# Altium project LOGI-PI.PrjPcb (part 1 of 2)
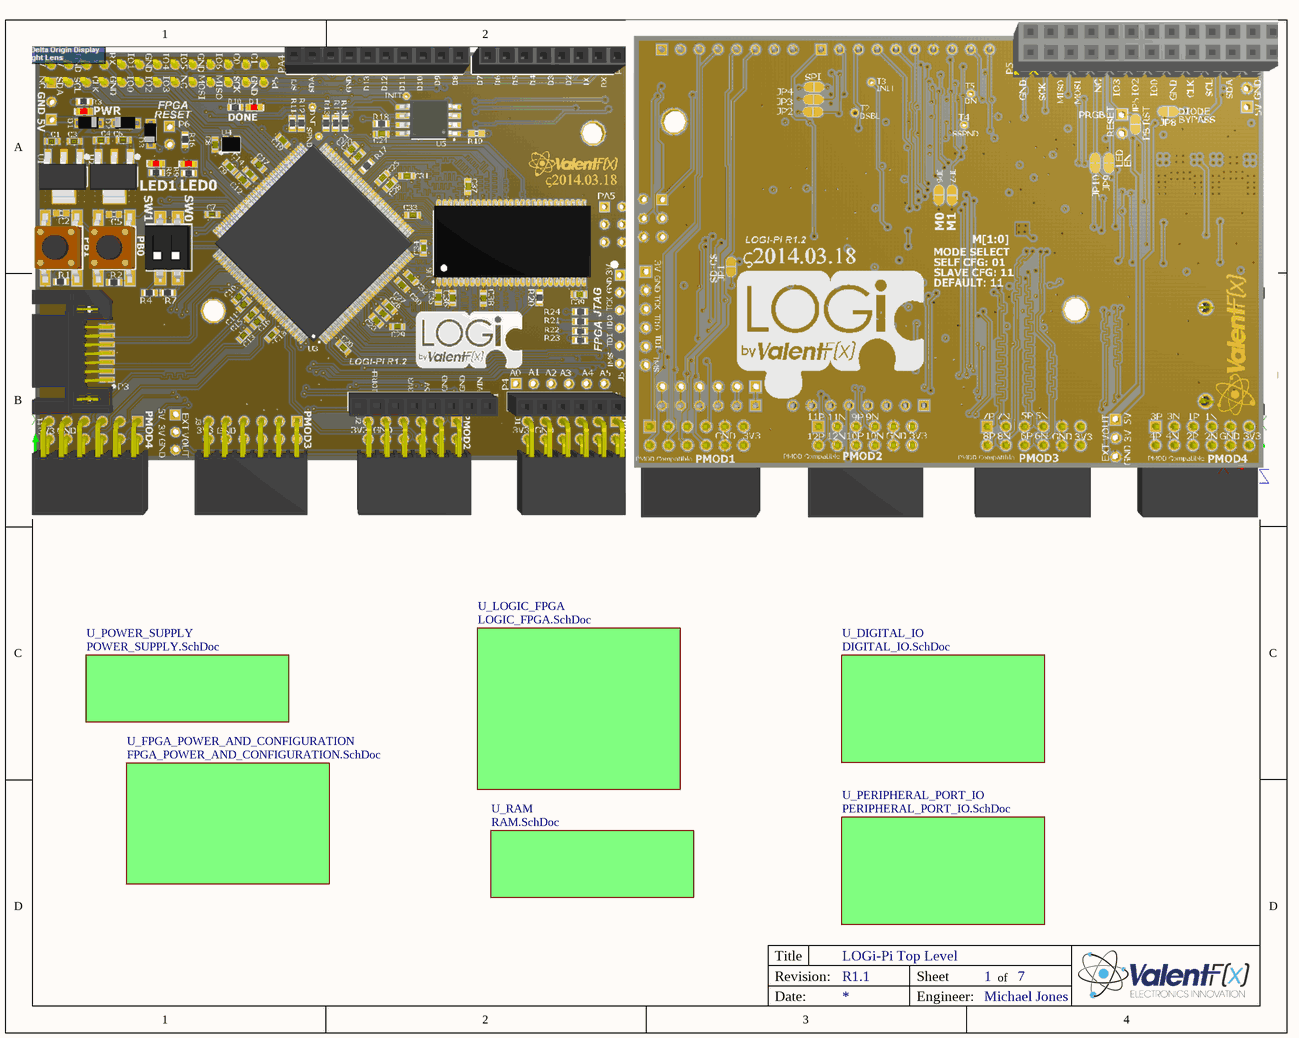
[diagram p0: LOGi_Pi_Top.SchDoc]
PrjEngineer: Michael Jones; PrjRevision: R1.1
7 sheets, 111 parts. Net scope: flat (ports and power ports of the same name join across sheets).
Board file: LOGI-PI.PcbDoc
Sheets:
  LOGi_Pi_Top.SchDoc
    U_DIGITAL_IO = DIGITAL_IO.SchDoc
    U_FPGA_POWER_AND_CONFIGURATION = FPGA_POWER_AND_CONFIGURATION.SchDoc
    U_LOGIC_FPGA = LOGIC_FPGA.SchDoc
    U_PERIPHERAL_PORT_IO = PERIPHERAL_PORT_IO.SchDoc
    U_POWER_SUPPLY = POWER_SUPPLY.SchDoc
    U_RAM = RAM.SchDoc

## Sheet LOGi_Pi_Top.SchDoc: LOGi-Pi Top Level
size A; Organization: Michael Jones; DocumentNumber: 1; SheetNumber: 1; SheetTotal: 7; PageSetup: Record=PageOptions|CenterHorizontal=True|CenterVertical=True|PrintScale=1.12|XCorrection=1.00|YCorrection=1.00|PrintKind=0|BorderSize=5000000|LeftOffset=0|BottomOffset=0|Orientation=2|PaperLength=1000|PaperWidth=1000|Scale=100|PaperSource=7|PrintQuality=-4|MediaType=1|DitherType=10|PaperKind=Letter|PrintScaleMode=1

### Sub-sheets
U_DIGITAL_IO = DIGITAL_IO.SchDoc: no entries
U_FPGA_POWER_AND_CONFIGURATION = FPGA_POWER_AND_CONFIGURATION.SchDoc: no entries
U_LOGIC_FPGA = LOGIC_FPGA.SchDoc: no entries
U_PERIPHERAL_PORT_IO = PERIPHERAL_PORT_IO.SchDoc: no entries
U_POWER_SUPPLY = POWER_SUPPLY.SchDoc: no entries
U_RAM = RAM.SchDoc: no entries

### Notes on the sheet
- Title
- Revision:
- Sheet
- of
- Date:
- Engineer:

## Sheet DIGITAL_IO.SchDoc: Digital IO
size B; Engineer: M. Jones; Organization: Michael Jones; DocumentNumber: 6; Revision: RA.1; SheetNumber: 6; SheetTotal: 7
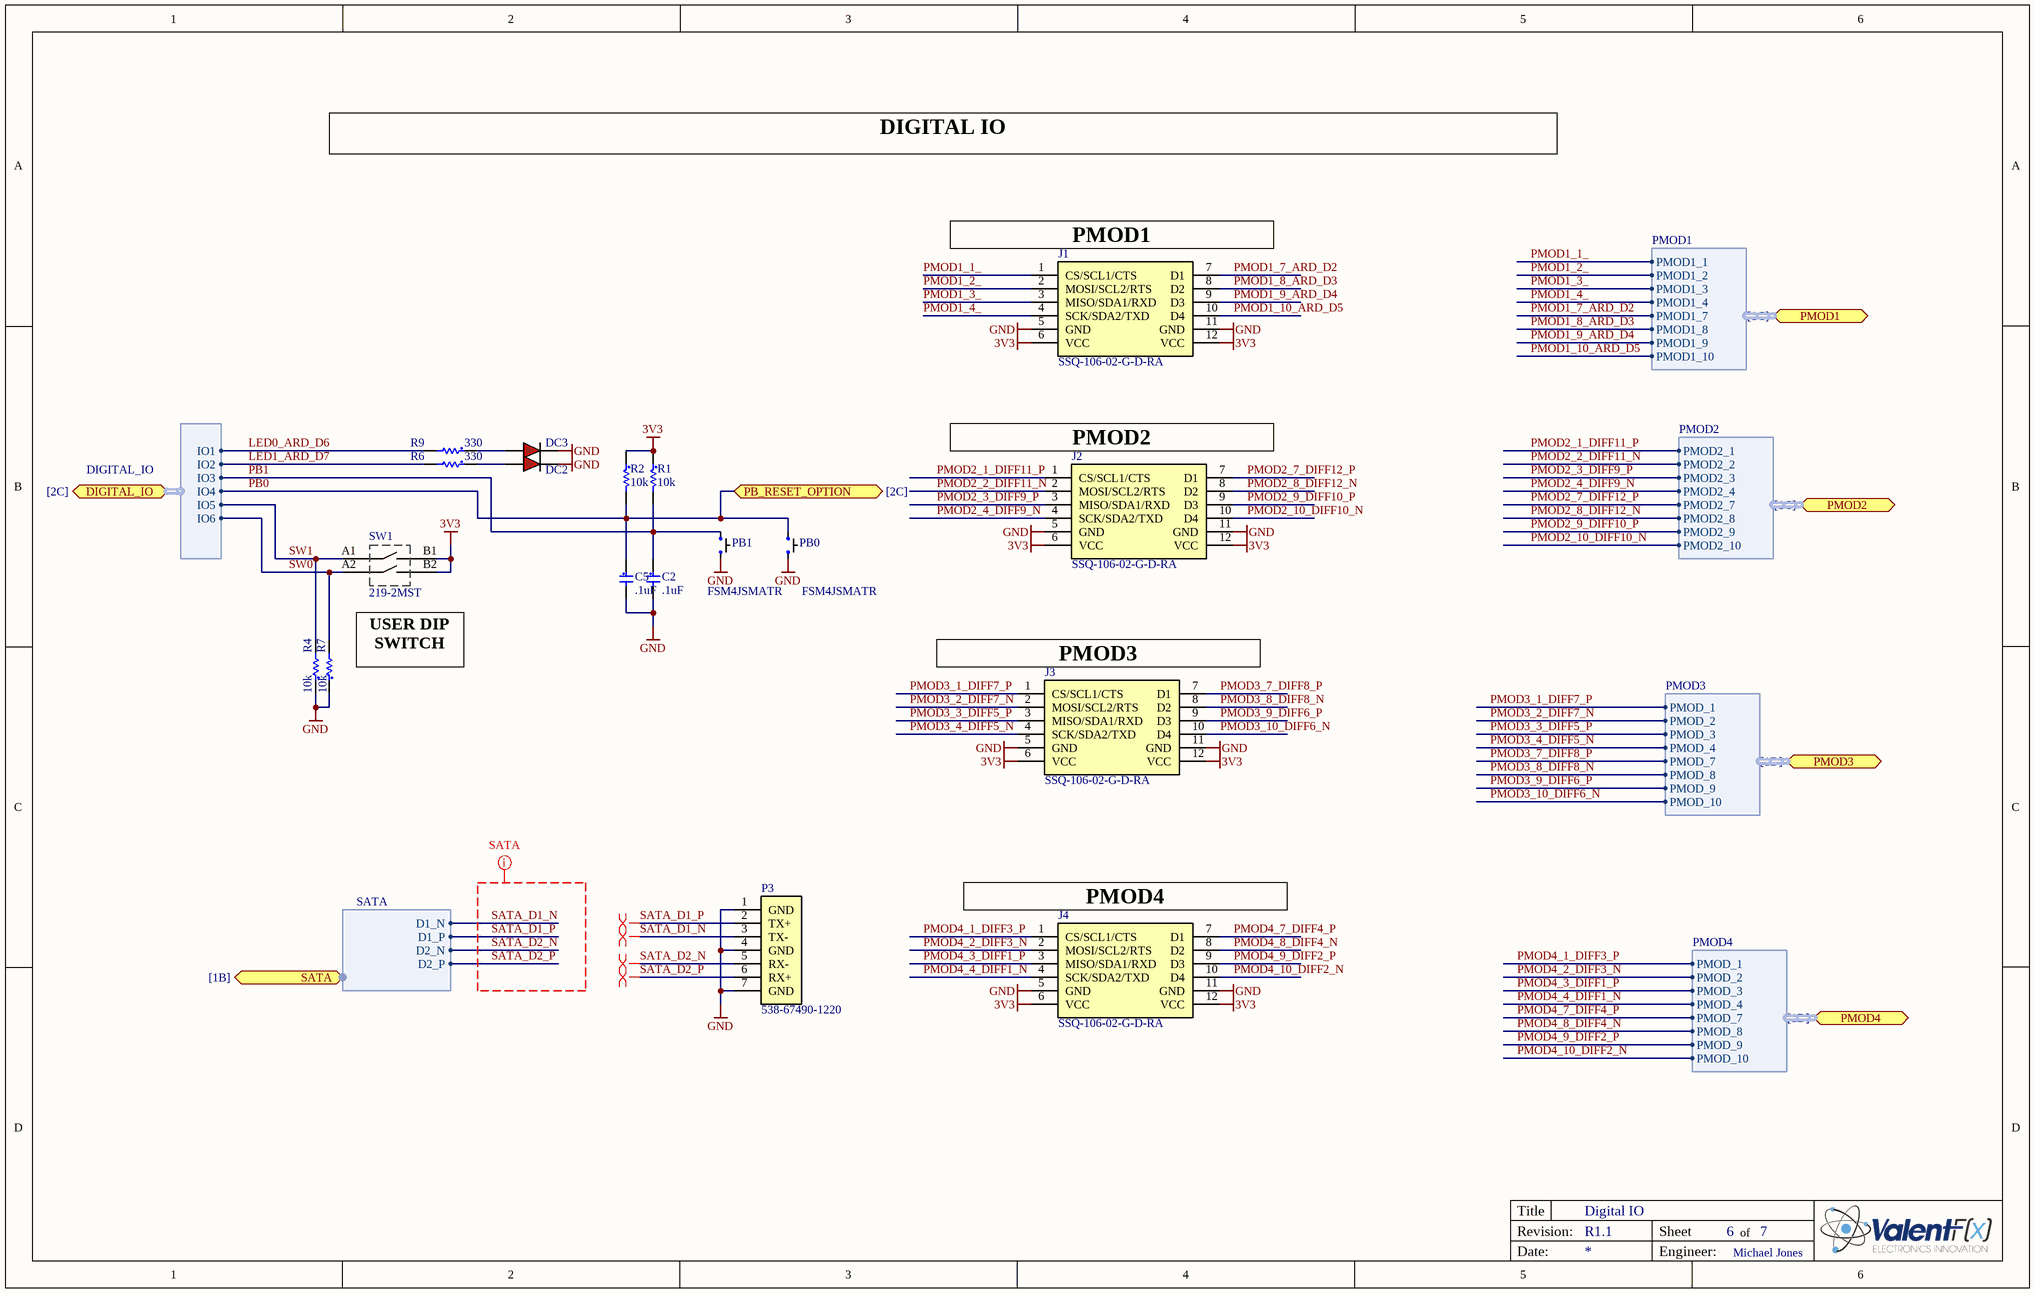
[diagram p1: DIGITAL_IO.SchDoc]

### Parts
C2  .1uF  [c0603]
C5  .1uF  [c0603]
DC2  598-8010-107F  [LED_0603 - RED]  (value not drawn)
DC3  598-8010-107F  [LED_0603 - RED]  (value not drawn)
J1  SSQ-106-02-G-D-RA  [PMOD HEADER - SSQ-106-02-G-D-RA]
J2  SSQ-106-02-G-D-RA  [PMOD HEADER - SSQ-106-02-G-D-RA]
J3  SSQ-106-02-G-D-RA  [PMOD HEADER - SSQ-106-02-G-D-RA]
J4  SSQ-106-02-G-D-RA  [PMOD HEADER - SSQ-106-02-G-D-RA]
P3  Supplier Part Number 1: 538-67490-1220  [SATA - 67490-3220]  (hidden comment: SATA - 67490-1220)
PB0  FSM4JSMATR  [FSM4JSMA]
PB1  FSM4JSMATR  [FSM4JSMA]
R1  10k  [R0603]
R2  10k  [R0603]
R4  10k  [R0603]
R6  330  [R0603]
R7  10k  [R0603]
R9  330  [R0603]
SW1  219-2MST  [DIPSW - 219-2MST]

### Ports
DIGITAL_IO (harness DIGITAL_IO, see [2C]), PB_RESET_OPTION (see [2C]), PMOD1 (harness PMOD1, see [1B], [1C]), PMOD2 (harness PMOD2, see [1B], [1C]), PMOD3 (harness PMOD3, see [1D]), PMOD4 (harness PMOD4, see [1D]), SATA (harness SATA, see [1B])

### Harnesses
DIGITAL_IO: IO1, IO2, IO3, IO4, IO5, IO6
SATA: D1_P, D1_N, D2_N, D2_P
PMOD1: PMOD1_1, PMOD1_2, PMOD1_3, PMOD1_4, PMOD1_7, PMOD1_8, PMOD1_9, PMOD1_10
PMOD2: PMOD2_1, PMOD2_2, PMOD2_3, PMOD2_4, PMOD2_7, PMOD2_8, PMOD2_9, PMOD2_10
PMOD3: PMOD_7, PMOD_8, PMOD_9, PMOD_10, PMOD_1, PMOD_2, PMOD_3, PMOD_4
PMOD4: PMOD_7, PMOD_8, PMOD_9, PMOD_10, PMOD_1, PMOD_2, PMOD_3, PMOD_4

### Nets
3V3: J1.6(VCC) J1.12(VCC) J2.6(VCC) J2.12(VCC) J3.6(VCC) J3.12(VCC) J4.6(VCC) J4.12(VCC) R1.1 R2.1 SW1.B1 SW1.B2
GND: C2.2 C5.2 DC2.C DC3.C J1.5(GND) J1.11(GND) J2.5(GND) J2.11(GND) J3.5(GND) J3.11(GND) J4.5(GND) J4.11(GND) P3.1(GND) P3.4(GND) P3.7(GND) PB0.A PB1.A R4.1 R7.1
LED0_ARD_D6: R9.2 ; port DIGITAL_IO.IO1
LED1_ARD_D7: R6.2 ; port DIGITAL_IO.IO2
PB0: C5.1 PB0.B R2.2 ; port PB_RESET_OPTION, port DIGITAL_IO.IO4
PB1: C2.1 PB1.B R1.2 ; port DIGITAL_IO.IO3
PMOD1_1_: J1.1(CS/SCL1/CTS) ; port PMOD1.PMOD1_1
PMOD1_2_: J1.2(MOSI/SCL2/RTS) ; port PMOD1.PMOD1_2
PMOD1_3_: J1.3(MISO/SDA1/RXD) ; port PMOD1.PMOD1_3
PMOD1_4_: J1.4(SCK/SDA2/TXD) ; port PMOD1.PMOD1_4
PMOD1_7_ARD_D2: J1.7(D1) ; port PMOD1.PMOD1_7
PMOD1_8_ARD_D3: J1.8(D2) ; port PMOD1.PMOD1_8
PMOD1_9_ARD_D4: J1.9(D3) ; port PMOD1.PMOD1_9
PMOD1_10_ARD_D5: J1.10(D4) ; port PMOD1.PMOD1_10
PMOD2_1_DIFF11_P: J2.1(CS/SCL1/CTS) ; port PMOD2.PMOD2_1  [project net PMOD1_1_]
PMOD2_2_DIFF11_N: J2.2(MOSI/SCL2/RTS) ; port PMOD2.PMOD2_2  [project net PMOD1_2_]
PMOD2_3_DIFF9_P: J2.3(MISO/SDA1/RXD) ; port PMOD2.PMOD2_3  [project net PMOD1_3_]
PMOD2_4_DIFF9_N: J2.4(SCK/SDA2/TXD) ; port PMOD2.PMOD2_4  [project net PMOD1_4_]
PMOD2_7_DIFF12_P: J2.7(D1) ; port PMOD2.PMOD2_7  [project net PMOD1_7_ARD_D2]
PMOD2_8_DIFF12_N: J2.8(D2) ; port PMOD2.PMOD2_8  [project net PMOD1_8_ARD_D3]
PMOD2_9_DIFF10_P: J2.9(D3) ; port PMOD2.PMOD2_9  [project net PMOD1_9_ARD_D4]
PMOD2_10_DIFF10_N: J2.10(D4) ; port PMOD2.PMOD2_10  [project net PMOD1_10_ARD_D5]
PMOD3_1_DIFF7_P: J3.1(CS/SCL1/CTS) ; port PMOD3.PMOD_1
PMOD3_2_DIFF7_N: J3.2(MOSI/SCL2/RTS) ; port PMOD3.PMOD_2
PMOD3_3_DIFF5_P: J3.3(MISO/SDA1/RXD) ; port PMOD3.PMOD_3
PMOD3_4_DIFF5_N: J3.4(SCK/SDA2/TXD) ; port PMOD3.PMOD_4
PMOD3_7_DIFF8_P: J3.7(D1) ; port PMOD3.PMOD_7
PMOD3_8_DIFF8_N: J3.8(D2) ; port PMOD3.PMOD_8
PMOD3_9_DIFF6_P: J3.9(D3) ; port PMOD3.PMOD_9
PMOD3_10_DIFF6_N: J3.10(D4) ; port PMOD3.PMOD_10
PMOD4_1_DIFF3_P: J4.1(CS/SCL1/CTS) ; port PMOD4.PMOD_1
PMOD4_2_DIFF3_N: J4.2(MOSI/SCL2/RTS) ; port PMOD4.PMOD_2
PMOD4_3_DIFF1_P: J4.3(MISO/SDA1/RXD) ; port PMOD4.PMOD_3
PMOD4_4_DIFF1_N: J4.4(SCK/SDA2/TXD) ; port PMOD4.PMOD_4
PMOD4_7_DIFF4_P: J4.7(D1) ; port PMOD4.PMOD_7
PMOD4_8_DIFF4_N: J4.8(D2) ; port PMOD4.PMOD_8
PMOD4_9_DIFF2_P: J4.9(D3) ; port PMOD4.PMOD_9
PMOD4_10_DIFF2_N: J4.10(D4) ; port PMOD4.PMOD_10
SATA_D1_N: P3.3(TX-) ; port SATA.D1_N
SATA_D1_P: P3.2(TX+) ; port SATA.D1_P
SATA_D2_N: P3.5(RX-) ; port SATA.D2_N
SATA_D2_P: P3.6(RX+) ; port SATA.D2_P
SW0: R7.2 SW1.A2 ; port DIGITAL_IO.IO6
SW1: R4.2 SW1.A1 ; port DIGITAL_IO.IO5
NetDC2_A: DC2.A R6.1
NetDC3_A: DC3.A R9.1

### Layout directives
net class SATA: SATA_D1_N, SATA_D1_P, SATA_D2_N, SATA_D2_P
differential pair: SATA_D1_N, SATA_D1_P, SATA_D2_N, SATA_D2_P

### Notes on the sheet
- DIGITAL IO
- (near J1) PMOD1
- (near J2) PMOD2
- USER DIP SWITCH
- (near J3) PMOD3
- (near J4) PMOD4
- Title
- Revision:
- Sheet
- of
- Date:
- Engineer:

### Library data of the parts
C2 C5 = C0603 - CL10F104ZA8NNNC: CAP CER 0.1UF 25V Y5V 0603; Manufacturer: Samsung Electro-Mechanics America, Inc; Capacitance: 0.1µF; Tolerance: -20%, +80%; Temperature Coefficient: Y5V (F); Accept Alternative: Yes; Value: .1uF; Supplier 1: Digi-Key; Supplier Part Number 1: 1276-1011-1-ND; Manufacturer Part Number: CL10F104ZA8NNNC; RoHS: RoHS Compliant; Category: Capacitors; Stock 1: 400907; Pricing 1: 1=0.1, 10=0.017, 25=0.012, 50=0.009, 100=0.0076, 250=0.00624, 500=0.00536, 1000=0.00417 (USD); Package / Case: 0603 (1608 Metric); Packaging: Cut Tape (CT); ComponentLink1URL: http://www.samsungsem.com/servlet/FileDownload?type=spec&file=CL10F104ZA8NNNC.pdf; ComponentLink1Description: http://www.samsungsem.com/servlet/FileDownload?type=spec&file=CL10F104ZA8NNNC.pdf; Voltage - Rated: 25V; Mounting Type: Surface Mount, MLCC; Operating Temperature: -30°C ~ 85°C; Applications: General Purpose; Ratings: -; Size / Dimension: 0.063" L x 0.031" W (1.60mm x 0.80mm); Height - Seated (Max): -; Thickness (Max): 0.035" (0.90mm); Lead Spacing: -; Features: -; Lead Style: -
DC2 DC3 = LED0603 - 598-8010-107F: LED ALINGAP RED CLEAR 0603 SMD; Manufacturer: Dialight; Current - Test: 20mA; Wavelength - Dominant: 635nm; Millicandela Rating: 40mcd; Voltage - Forward (Vf) Typ: 2.2V; Lens Style/Size: Rectangle with Flat Top, 1.1mm x 0.8mm; Viewing Angle: 140°; Accept Replacement: YES - Water Clear; Supplier 1: Digi-Key; Manufacturer Part Number: 598-8010-107F; RoHS: RoHS Compliant; Category: Optoelectronics; Stock 1: 37578; Pricing 1: 1=0.45, 10=0.33, 25=0.264, 100=0.1749, 250=0.1452, 500=0.1056, 1000=0.0825 (USD); Color: Red; Luminous Flux @ Current - Test: -; Wavelength - Peak: -; Lens Type: Clear; Size / Dimension: 1.60mm L x 0.80mm W; Height: 0.70mm; Package / Case: 0603 (1608 Metric); Mounting Type: Surface Mount; Packaging: Digi-Reel®; ComponentLink1URL: http://media.digikey.com/pdf/Data%20Sheets/Dialight%20PDFs/598_Series_0603_Pkg.pdf; ComponentLink1Description: http://media.digikey.com/pdf/Data%20Sheets/Dialight%20PDFs/598_Series_0603_Pkg.pdf; Supplier Part Number 1: 350-2029-6-ND
J1-J4 = P-MOD - SSQ-106-02-G-D-RA: SAMTEC - SSQ-106-02-G-D-RA-005 - 2MM SOCKET STRIPS; Supplier 1: Samtec; Supplier Part Number 1: SSQ-106-02-G-D-RA; Manufacturer: SAMTEC; Manufacturer Part Number: SSQ-106-02-G-D-RA; Stock 1: 0; Pricing 1: 1=1.58, 100=1.58, 1000=1.58 (USD); Value: SSQ-106-02-G-D-RA
P3 = SATA - 67490-1220: SATA Data - 67490-1220; Manufacturer: Molex; 1Notes: looks more standard need, different footprint; Gender: Male; Pitch: 1.27 mm; Number of Positions / Contacts: 7; Supplier 1: Mouser; Manufacturer Part Number: 67490-1220; RoHS: RoHS Compliant; Category: I/O Connectors; Stock 1: 475; Pricing 1: 1=1.28, 10=1.07, 100=0.792, 500=0.640, 1000=0.572, 2000=0.525 (AUD); Packaging: Tray; Product: SATA Connectors; Termination Style: Solder Terminal; Mounting Style: SMD/SMT; Product Category: 1.27mm Connectors; Standard Pack Qty: 2880; RoHS - Mouser: Y; Minimum Order Quantity: 1; Reeling: False; ComponentLink1URL: http://www.molex.com/webdocs/datasheets/pdf/en-us/0674901220_PCB_HEADERS.pdf; ComponentLink1Description: http://www.molex.com/webdocs/datasheets/pdf/en-us/0674901220_PCB_HEADERS.pdf
PB0 PB1 = FSM4JSMATR: SWITCH TACTILE SPST-NO 0.05A 12V; Manufacturer: TE Connectivity; Switch Function: Off-Mom; Contact Rating @ Voltage: 0.05A @ 12VDC; Actuator Type: Standard; Outline: 6.00mm x 6.00mm; Illumination: Non-Illuminated; Operating Force: 160gf; Actuator Height off PCB, from Pins: 5.00mm; Actuator Orientation: Top Actuated; Actuator Material: Polyphenylene Sulfide (PPS); Switch Travel: 0.25mm; Mechanical Life: 100,000 Cycles; Supplier 1: Digi-Key; Supplier Part Number 1: 450-1129-ND; Manufacturer Part Number: FSM4JSMA; RoHS: RoHS Compliant; Category: Switches; Stock 1: 13038; Pricing 1: 1=0.26, 10=0.246, 25=0.2096, 50=0.1834, 100=0.1703, 250=0.15064, 500=0.1441, 1000=0.1179, 5000=0.09825 (USD); Circuit: SPST-NO; Mounting Type: Surface Mount; Termination Style: Gull Wing; Packaging: Bulk; ComponentLink1URL: http://www.te.com/commerce/DocumentDelivery/DDEController?Action=srchrtrv&DocNm=2-1437565-7&DocType=Customer+Drawing&DocLang=English; ComponentLink1Description: http://www.te.com/commerce/DocumentDelivery/DDEController?Action=srchrtrv&DocNm=2-1437565-7&DocType=Customer+Drawing&DocLang=English; Illumination Voltage (Nominal): -; Illumination Type, Color: -; Ingress Protection: -; Features: -; Operating Temperature: -35°C ~ 85°C; Value: FSM4JSMATR
R1 R2 R4 R7 = R0603 - CRCW060310K0FKEA: 10k Thick Film Resistors - SMD 1/10watt 10Kohms 1%; Manufacturer: Vishay Dale; Power (Watts): 0.1W, 1/10W; Temperature Coefficient: ±100ppm/°C; Supplier 1: Digi-Key; Manufacturer Part Number: CRCW060310K0FKEA; RoHS: RoHS Compliant; Category: Resistors; Stock 1: 997856; Pricing 1: 10=0.081, 50=0.0436, 200=0.0251, 1000=0.01711 (USD); Resistance (Ohms): 10K; Composition: Thick Film; Features: -; Tolerance: ±1%; Package / Case: 0603 (1608 Metric); Size / Dimension: 0.061" L x 0.033" W (1.55mm x 0.85mm); Height: 0.020" (0.50mm); Number of Terminations: 2; Packaging: Cut Tape (CT); ComponentLink1URL: http://www.vishay.com/doc?20035; ComponentLink1Description: http://www.vishay.com/doc?20035; Supplier Part Number 1: 541-10.0KHCT-ND; Value: 10k
R6 R9 = R0603 - ERJ-3GEYJ331V: Thick Film Resistors - SMD 0603 330ohms 5% Tol; Manufacturer: Panasonic; Temperature Coefficient: 200 PPM / C; Power Rating: 100 mW; Voltage Rating: 75 V; Manufacturer Part Number: ERJ-3GEYJ331V; Value: 330; Supplier 1: Mouser; Supplier Part Number 1: 667-ERJ-3GEYJ331V; RoHS: RoHS Compliant By Exemption; Category: Thick Film Resistors - SMD; Stock 1: 131470; Pricing 1: 1=0.108, 10=0.012, 100=0.005, 1000=0.004, 5000=0.003 (AUD); Tolerance: 5 %; Packaging: Reel; Package / Case: 0603 (1608 metric); ComponentLink1URL: http://www.mouser.com/ds/2/315/AOA0000CE1-37422.pdf; ComponentLink1Description: http://www.mouser.com/ds/2/315/AOA0000CE1-37422.pdf; Dimensions: 0.8 mm W x 1.6 mm L x 0.45 mm H; Operating Temperature Range: - 55 C to + 155 C; Product: Thick Film Resistors SMD; Resistance: 330 Ohms; Series: ERJ; Termination Style: SMD/SMT; Case Code - in: 0603; Case Code - mm: 1608; Standard Pack Qty: 5000; RoHS - Mouser: E; Minimum Order Quantity: 1; Reeling: True
SW1 = DIPSW - 219-2MST: DIP Switches / SIP Switches SPST 2 switch sections; Manufacturer: CTS Electronic Components; Number of Positions: 2; Supplier 1: Mouser; Manufacturer Part Number: 219-2MST; RoHS: RoHS Compliant; Category: DIP Switches / SIP Switches; Stock 1: 3237; Pricing 1: 1=0.580, 10=0.530, 100=0.480, 500=0.350, 1000=0.300, 5000=0.270 (USD); Operating Temperature Range: - 55 C to + 85 C; Packaging: Tube; Terminal Pitch: 2.54 mm; Termination Style: SMD/SMT; Switch Type: DIP; Product Category: DIP Switches; RoHS - Mouser: Y; Minimum Order Quantity: 1; Reeling: False; ComponentLink1URL: http://www.ctscorp.com/components/Datasheets/219.pdf; ComponentLink1Description: http://www.ctscorp.com/components/Datasheets/219.pdf; Supplier Part Number 1: 774-2192MST; Value: 219-2MST

## Sheet FPGA_POWER_AND_CONFIGURATION.SchDoc: FPGA Configuration
size B; Engineer: M. Jones; Organization: Michael Jones; DocumentNumber: 3; Revision: RA.1; SheetNumber: 3; SheetTotal: 7
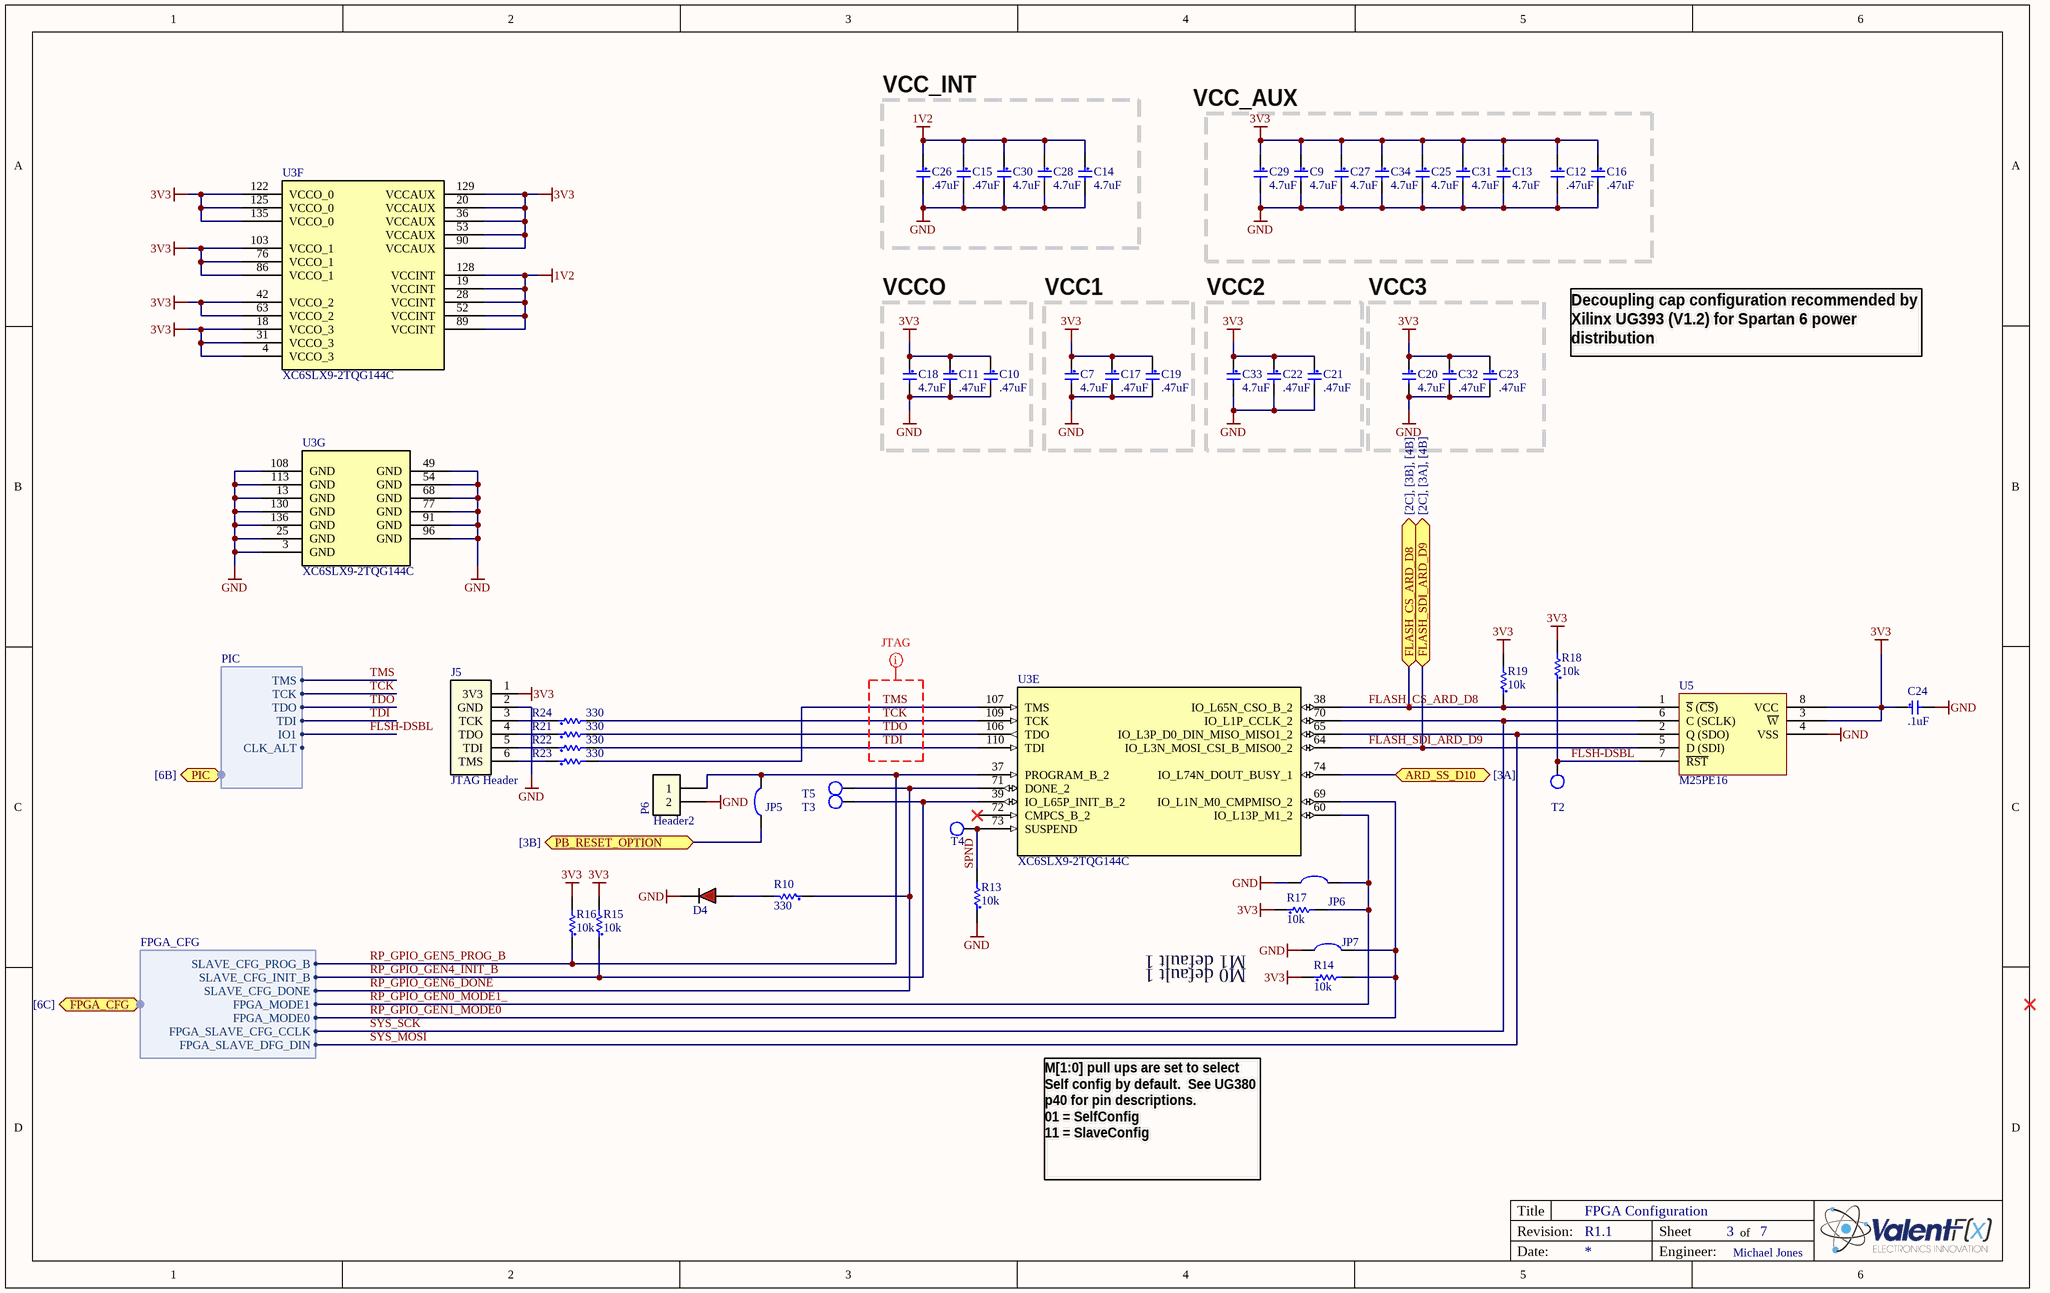
[diagram p2: FPGA_POWER_AND_CONFIGURATION.SchDoc]

### Parts
C7  4.7uF  [C0603 - Marked]
C9  4.7uF  [C0603 - Marked]
C10  .47uF  [C0603]
C11  .47uF  [C0603]
C12  .47uF  [C0603]
C13  4.7uF  [C0603 - Marked]
C14  4.7uF  [C0603 - Marked]
C15  .47uF  [C0603]
C16  .47uF  [C0603]
C17  .47uF  [C0603]
C18  4.7uF  [C0603 - Marked]
C19  .47uF  [C0603]
C20  4.7uF  [C0603 - Marked]
C21  .47uF  [C0603]
C22  .47uF  [C0603]
C23  .47uF  [C0603]
C24  .1uF  [c0603]
C25  4.7uF  [C0603 - Marked]
C26  .47uF  [C0603]
C27  4.7uF  [C0603 - Marked]
C28  4.7uF  [C0603 - Marked]
C29  4.7uF  [C0603 - Marked]
C30  4.7uF  [C0603 - Marked]
C31  4.7uF  [C0603 - Marked]
C32  .47uF  [C0603]
C33  4.7uF  [C0603 - Marked]
C34  4.7uF  [C0603 - Marked]
D4  598-8010-107F  [LED_0603 - RED]  (value not drawn)
J5  JTAG Header  [JTAG - Digilent HS1]  (no BOM)
JP5  Solder Jumper  [SOLDER_JUMPER]  (value not drawn)  (no BOM)
JP6  Solder Jumper  [SOLDER_JUMPER]  (value not drawn)  (no BOM)
JP7  Solder Jumper  [SOLDER_JUMPER]  (value not drawn)  (no BOM)
P6  Header2  [HEADER_2_40_100 THRU SIP]  (no BOM)
R10  330  [R0603]
R13  10k  [R0603]
R14  10k  [R0603]
R15  10k  [R0603]
R16  10k  [R0603]
R17  10k  [R0603]
R18  10k  [R0603]
R19  10k  [R0603]
R21  330  [R0603]
R22  330  [R0603]
R23  330  [R0603]
R24  330  [R0603]
T2  Test Point  [Tp 25-40]  (value not drawn)  (no BOM)
T3  Test Point  [Tp 25-40]  (value not drawn)  (no BOM)
T4  Test Point  [Tp 25-40]  (value not drawn)  (no BOM)
T5  Test Point  [Tp 25-40]  (value not drawn)  (no BOM)
U3  XC6SLX9-2TQG144C  [TQ144_L]  (parts E,F,G of 7)
U5  M25PE16  [SOIC127P830X200-8L]

### Blocks framed on the sheet
VCC_INT: C14 C15 C26 C28 C30
VCCO: C10 C11 C18
VCC1: C7 C17 C19
VCC2: C21 C22 C33
VCC3: C20 C23 C32

### Ports
ARD_SS_D10 (see [3A]), FLASH_CS_ARD_D8 (see [2C], [3B], [4B]), FLASH_SDI_ARD_D9 (see [2C], [3A], [4B]), FPGA_CFG (harness FPGA_CFG, see [6C]), PB_RESET_OPTION (see [3B]), PIC (harness PIC, see [6B])

### Harnesses
FPGA_CFG: SLAVE_CFG_PROG_B, SLAVE_CFG_INIT_B, SLAVE_CFG_DONE, FPGA_MODE0, FPGA_MODE1, FPGA_SLAVE_CFG_CCLK, FPGA_SLAVE_DFG_DIN
PIC: TMS, TCK, TDO, TDI, CLK_ALT, IO1

### Nets
1V2: C14.1 C15.1 C26.1 C28.1 C30.1 U3.19(VCCINT) U3.28(VCCINT) U3.52(VCCINT) U3.89(VCCINT) U3.128(VCCINT)
3V3: C7.1 C9.1 C10.1 C11.1 C12.1 C13.1 C16.1 C17.1 C18.1 C19.1 C20.1 C21.1 C22.1 C23.1 C24.1 C25.1 C27.1 C29.1 C31.1 C32.1 C33.1 C34.1 J5.1(3V3) R14.1 R15.2 R16.2 R17.1 R18.2 R19.2 U3.4(VCCO_3) U3.18(VCCO_3) U3.20(VCCAUX) U3.31(VCCO_3) U3.36(VCCAUX) U3.42(VCCO_2) U3.53(VCCAUX) U3.63(VCCO_2) U3.76(VCCO_1) U3.86(VCCO_1) U3.90(VCCAUX) U3.103(VCCO_1) U3.122(VCCO_0) U3.125(VCCO_0) U3.129(VCCAUX) U3.135(VCCO_0) U5.3(~{W}) U5.8(VCC)
GND: C7.2 C9.2 C10.2 C11.2 C12.2 C13.2 C14.2 C15.2 C16.2 C17.2 C18.2 C19.2 C20.2 C21.2 C22.2 C23.2 C24.2 C25.2 C26.2 C27.2 C28.2 C29.2 C30.2 C31.2 C32.2 C33.2 C34.2 D4.C J5.2(GND) JP6.2 JP7.2 P6.2 R13.1 U3.3(GND) U3.13(GND) U3.25(GND) U3.49(GND) U3.54(GND) U3.68(GND) U3.77(GND) U3.91(GND) U3.96(GND) U3.108(GND) U3.113(GND) U3.130(GND) U3.136(GND) U5.4(VSS)
ARD_SS_D10: U3.74(IO_L74N_DOUT_BUSY_1) ; port ARD_SS_D10
FLASH_CS_ARD_D8: R19.1 U3.38(IO_L65N_CSO_B_2) U5.1(~{S}_(~{CS})) ; port FLASH_CS_ARD_D8
FLASH_SDI_ARD_D9: U3.64(IO_L3N_MOSI_CSI_B_MISO0_2) U5.5(D_(SDI)) ; port FLASH_SDI_ARD_D9
FLSH-DSBL: R18.1 T2.1 U5.7(~{RST}) ; port PIC.IO1
PB0: JP5.2 ; port PB_RESET_OPTION
RP_GPIO_GEN0_MODE1_: JP6.1 R17.2 U3.60(IO_L13P_M1_2) ; port FPGA_CFG.FPGA_MODE1
RP_GPIO_GEN1_MODE0: JP7.1 R14.2 U3.69(IO_L1N_M0_CMPMISO_2) ; port FPGA_CFG.FPGA_MODE0
RP_GPIO_GEN4_INIT_B: R15.1 T3.1 U3.39(IO_L65P_INIT_B_2) ; port FPGA_CFG.SLAVE_CFG_INIT_B
RP_GPIO_GEN5_PROG_B: JP5.1 P6.1 R16.1 U3.37(PROGRAM_B_2) ; port FPGA_CFG.SLAVE_CFG_PROG_B
RP_GPIO_GEN6_DONE: R10.1 T5.1 U3.71(DONE_2) ; port FPGA_CFG.SLAVE_CFG_DONE
SPND: R13.2 T4.1 U3.73(SUSPEND)
SYS_MOSI: U3.65(IO_L3P_D0_DIN_MISO_MISO1_2) U5.2(Q_(SDO)) ; port FPGA_CFG.FPGA_SLAVE_DFG_DIN
SYS_SCK: U3.70(IO_L1P_CCLK_2) U5.6(C_(SCLK)) ; port FPGA_CFG.FPGA_SLAVE_CFG_CCLK
TCK: R24.2 U3.109(TCK) ; port PIC.TCK
TDI: R22.2 U3.110(TDI) ; port PIC.TDI
TDO: R21.2 U3.106(TDO) ; port PIC.TDO
TMS: R23.2 U3.107(TMS) ; port PIC.TMS
NetD4_A: D4.A R10.2
NetJ5_3: J5.3(TCK) R24.1
NetJ5_4: J5.4(TDO) R21.1
NetJ5_5: J5.5(TDI) R22.1
NetJ5_6: J5.6(TMS) R23.1

Not connected (* = marked no-connect by the designer): U3 72(CMPCS_B_2)*

### Layout directives
net class JTAG: TCK, TDI, TDO, TMS

### Notes on the sheet
- VCC_AUX
- Decoupling cap configuration recommended by Xilinx UG393 (V1.2) for Spartan 6 power distribution
- M0 default 1
- M1 default 1
- M[1:0] pull ups are set to select Self config by default.  See UG380 p40 for pin descriptions.
  01 = SelfConfig
  11 = SlaveConfig
- Title
- Revision:
- Sheet
- of
- Date:
- Engineer:

### Library data of the parts
C7 C9 C13 C14 C18 C20 C25 C27-C31 C33 C34 = C0603 - GRM188R60J475KE19D: 4.7uF 6.3volts X5R 10% (MLCC) - SMD/SMT 0603; Manufacturer: Murata Electronics North America; Capacitance: 4.7µF; Voltage - Rated: 6.3V; Supplier 1: Digi-Key; Manufacturer Part Number: GRM188R60J475KE19D; RoHS: RoHS Compliant; Category: Capacitors; Stock 1: 614848; Pricing 1: 1=0.19, 10=0.132, 50=0.076, 100=0.0627, 250=0.05284, 500=0.04426, 1000=0.03633 (USD); Tolerance: ±10%; Package / Case: 0603 (1608 Metric); Packaging: Cut Tape (CT); ComponentLink1URL: http://search.murata.co.jp/Ceramy/image/img/PDF/ENG/GRM188R60J475KE19.pdf; ComponentLink1Description: http://search.murata.co.jp/Ceramy/image/img/PDF/ENG/GRM188R60J475KE19.pdf; Value: 4.7uF; Temperature Coefficient: X5R; Mounting Type: Surface Mount, MLCC; Operating Temperature: -55°C ~ 85°C; Applications: General Purpose; Ratings: -; Size / Dimension: 0.063" L x 0.031" W (1.60mm x 0.80mm); Height - Seated (Max): -; Thickness (Max): 0.035" (0.90mm); Lead Spacing: -; Features: -; Lead Style: -; Supplier Part Number 1: 490-3297-1-ND
C10-C12 C15-C17 C19 C21-C23 C26 C32 = C0603 - GCM188R71E474KA64D: .47uF 25VDC X7R 10% SMD 0603 Paper T/R CERAMIC; Manufacturer: Murata Electronics North America; Capacitance: 0.47µF; Voltage - Rated: 25V; Supplier 1: Digi-Key; Supplier Part Number 1: 490-4776-1-ND; Manufacturer Part Number: GCM188R71E474KA64D; RoHS: RoHS Compliant; Stock 1: 100000; Pricing 1: 1=0.26, 10=0.214, 50=0.1202, 100=0.1068, 250=0.08012, 500=0.07076, 1000=0.06275 (USD); ComponentLink1URL: http://search.murata.co.jp/Ceramy/image/img/PDF/ENG/GCM188R71E474KA64.pdf; ComponentLink1Description: http://search.murata.co.jp/Ceramy/image/img/PDF/ENG/GCM188R71E474KA64.pdf; Value: .47uF; Category: Capacitors; Tolerance: ±10%; Temperature Coefficient: X7R; Mounting Type: Surface Mount, MLCC; Operating Temperature: -55°C ~ 125°C; Applications: Automotive; Ratings: AEC-Q200; Package / Case: 0603 (1608 Metric); Size / Dimension: 0.063" L x 0.031" W (1.60mm x 0.80mm); Height - Seated (Max): -; Thickness (Max): 0.035" (0.90mm); Lead Spacing: -; Features: -; Packaging: Cut Tape (CT); Lead Style: -
C24 = C0603 - CL10F104ZA8NNNC: as C2 on sheet DIGITAL_IO; Manufacturer Part Number: CL10F104ZA8NNNC; Value: .1uF; Supplier 1: Digi-Key; Supplier Part Number 1: 1276-1011-1-ND; RoHS: RoHS Compliant; Category: Capacitors; Stock 1: 400907; Pricing 1: 1=0.1, 10=0.017, 25=0.012, 50=0.009, 100=0.0076, 250=0.00624, 500=0.00536, 1000=0.00417 (USD); Package / Case: 0603 (1608 Metric); Packaging: Cut Tape (CT); ComponentLink1URL: http://www.samsungsem.com/servlet/FileDownload?type=spec&file=CL10F104ZA8NNNC.pdf; ComponentLink1Description: http://www.samsungsem.com/servlet/FileDownload?type=spec&file=CL10F104ZA8NNNC.pdf; Voltage - Rated: 25V; Mounting Type: Surface Mount, MLCC; Operating Temperature: -30°C ~ 85°C; Applications: General Purpose; Ratings: -; Size / Dimension: 0.063" L x 0.031" W (1.60mm x 0.80mm); Height - Seated (Max): -; Thickness (Max): 0.035" (0.90mm); Lead Spacing: -; Features: -; Lead Style: -
D4 = LED0603 - 598-8010-107F: as DC2 on sheet DIGITAL_IO; Supplier 1: Digi-Key; Supplier Part Number 1: 350-2029-6-ND; Manufacturer Part Number: 598-8010-107F; RoHS: RoHS Compliant; Category: Optoelectronics; Stock 1: 37578; Pricing 1: 1=0.45, 10=0.33, 25=0.264, 100=0.1749, 250=0.1452, 500=0.1056, 1000=0.0825 (USD); Color: Red; Luminous Flux @ Current - Test: -; Wavelength - Peak: -; Lens Type: Clear; Size / Dimension: 1.60mm L x 0.80mm W; Height: 0.70mm; Package / Case: 0603 (1608 Metric); Mounting Type: Surface Mount; Packaging: Digi-Reel®; ComponentLink1URL: http://media.digikey.com/pdf/Data%20Sheets/Dialight%20PDFs/598_Series_0603_Pkg.pdf; ComponentLink1Description: http://media.digikey.com/pdf/Data%20Sheets/Dialight%20PDFs/598_Series_0603_Pkg.pdf
J5 = JTAG - Digilent HS1: DIGILENT - 410-205 - PROGRAMMING CABLE, JTAG HS1, USB2; Manufacturer: Samtec; Manufacturer Part Number: TSW-106-08-G-S-RA; Lead Time: 0 weeks; Peak Solder Temperature: 260 deg C; MSL Level Min: N/R; Connector Type: Header, Unshrouded; Number of Positions: 6; Number of Positions Loaded: All; Pitch: 0.100" (2.54mm); Supplier 1: Arrow; RoHS: CHINA ROHS: Compliant / EU ROHS: Compliant; Stock 1: 0; Pricing 1: 0=0.2649 (USD); ComponentLink1URL: http://components.arrow.com/partservice/dataview/altium/2677508S3639200N1004?apiKey=aa438727d59eed98c4bed826d8d949c84cb5e685b92bf87346a0226bd2658797; ComponentLink1Description: http://components.arrow.com/partservice/dataview/altium/2677508S3639200N1004?apiKey=aa438727d59eed98c4bed826d8d949c84cb5e685b92bf87346a0226bd2658797; Supplier Part Number 1: 2677508S3639200N1004; Package Quantity: 1; Termination Finish: Au/Ni; MSL Level Max: N/R; MSL (Moisture Sensitivity Level): N/R; China ROHS Lead (X -> above / O -> below threshold): O; China ROHS Mercury (X -> above / O -> below threshold): O; China ROHS Cadmium (X -> above / O -> below threshold): O; China ROHS Hex Chromium (X -> above / O -> below threshold): O; China ROHS PBB (X -> above / O -> below threshold): O; China ROHS PBDE (X -> above / O -> below threshold): O; EU_ROHS_PROD_EXEMPTION_BY_SUPP: N/R; Supplier 2: Digi-Key; Category: Connectors, Interconnects; Stock 2: 0; Pricing 2: 1=0.94, 10=0.841, 100=0.6926, 500=0.5475, 1000=0.46999, 5000=0.42877, 10000=0.41228 (USD); Contact Type: Male Pin; Number of Rows: 1; Row Spacing: -; Contact Mating Length: 0.230" (5.84mm); Mounting Type: Through Hole; Termination: Solder; Fastening Type: -; Features: -; Contact Finish: Gold; Contact Finish Thickness: 10µin (0.25µm); Color: Black; Packaging: Bulk; ComponentLink2URL: http://www.samtec.com/documents/webfiles/cpdf/TSW-XXX-XX-XXX-X-XX-XXX-MKT.pdf; ComponentLink2Description: http://www.samtec.com/documents/webfiles/cpdf/TSW-XXX-XX-XXX-X-XX-XXX-MKT.pdf; Supplier Part Number 2: SAM1038-06-ND; Value: JTAG Header
JP5-JP7 = Solder Jumper: Solder/Configuration Jumper; Manufacturer: n/a; Manufacturer Part Number: n/a; Source: n/a; Source Part Number: n/a; ROHS Certificate: n/a
P6 = Header2: Header 2 pin
R10 = R0603 - ERJ-3GEYJ331V: as R6 on sheet DIGITAL_IO; Manufacturer Part Number: ERJ-3GEYJ331V; Value: 330; Supplier 1: Mouser; Supplier Part Number 1: 667-ERJ-3GEYJ331V; RoHS: RoHS Compliant By Exemption; Category: Thick Film Resistors - SMD; Stock 1: 131470; Pricing 1: 1=0.108, 10=0.012, 100=0.005, 1000=0.004, 5000=0.003 (AUD); Tolerance: 5 %; Packaging: Reel; Package / Case: 0603 (1608 metric); ComponentLink1URL: http://www.mouser.com/ds/2/315/AOA0000CE1-37422.pdf; ComponentLink1Description: http://www.mouser.com/ds/2/315/AOA0000CE1-37422.pdf; Dimensions: 0.8 mm W x 1.6 mm L x 0.45 mm H; Operating Temperature Range: - 55 C to + 155 C; Product: Thick Film Resistors SMD; Resistance: 330 Ohms; Series: ERJ; Termination Style: SMD/SMT; Case Code - in: 0603; Case Code - mm: 1608; Standard Pack Qty: 5000; RoHS - Mouser: E; Minimum Order Quantity: 1; Reeling: True
R13-R19 = R0603 - CRCW060310K0FKEA: as R1 on sheet DIGITAL_IO; Manufacturer Part Number: CRCW060310K0FKEA; Value: 10k; Supplier 1: Digi-Key; RoHS: RoHS Compliant; Category: Resistors; Stock 1: 997856; Pricing 1: 10=0.081, 50=0.0436, 200=0.0251, 1000=0.01711 (USD); Resistance (Ohms): 10K; Composition: Thick Film; Features: -; Tolerance: ±1%; Size / Dimension: 0.061" L x 0.033" W (1.55mm x 0.85mm); Height: 0.020" (0.50mm); Packaging: Cut Tape (CT); Package / Case: 0603 (1608 Metric); ComponentLink1URL: http://www.vishay.com/doc?20035; ComponentLink1Description: http://www.vishay.com/doc?20035; Supplier Part Number 1: 541-10.0KHCT-ND; Number of Terminations: 2
R21-R24 = R0603 - ERJ-3GEYJ331V: Thick Film Resistors - SMD 0603 330ohms 5% Tol; Manufacturer: Panasonic; Power Rating: 100 mW; Temperature Coefficient: 200 PPM / C; Voltage Rating: 75 V; Supplier 1: Mouser; Manufacturer Part Number: ERJ-3GEYJ331V; RoHS: RoHS Compliant By Exemption; Category: Thick Film Resistors - SMD; Stock 1: 131470; Pricing 1: 1=0.108, 10=0.012, 100=0.005, 1000=0.004, 5000=0.003 (AUD); Dimensions: 0.8 mm W x 1.6 mm L x 0.45 mm H; Operating Temperature Range: - 55 C to + 155 C; Package / Case: 0603 (1608 metric); Packaging: Reel; Product: Thick Film Resistors SMD; Resistance: 330 Ohms; Series: ERJ; Termination Style: SMD/SMT; Tolerance: 5 %; Standard Pack Qty: 5000; RoHS - Mouser: E; Minimum Order Quantity: 1; Reeling: True; ComponentLink1URL: http://www.mouser.com/ds/2/315/AOA0000CE1-37422.pdf; ComponentLink1Description: http://www.mouser.com/ds/2/315/AOA0000CE1-37422.pdf; Supplier Part Number 1: 667-ERJ-3GEYJ331V; Value: 330; Case Code - in: 0603; Case Code - mm: 1608
T2-T5 = Test Point 2: Test Point Smaller Symbol
U3 = FPGA - XC6SLX9-2TQG144C: IC FPAG SPARTAN 6 9K 144TQFP; Manufacturer: Xilinx Inc; Number of Logic Elements/Cells: 9152; Number of LABs/CLBs: 715; Total RAM Bits: 589824; Number of I /O: 102; Voltage - Supply: 1.14 V ~ 1.26 V; Supplier 1: America II Electronics; Supplier Part Number 1: 122-1745-ND; Manufacturer Part Number: XC6SLX9-2TQG144C; RoHS: RoHS Compliant; Category: Integrated Circuits (ICs); Stock 1: 994; Pricing 1: 1=12.80,100=11.05,1000=9.59 (USD); Number of Gates: -; Mounting Type: Surface Mount; Operating Temperature: 0°C ~ 85°C; Package / Case: 144-LQFP; Supplier Device Package: 144-TQFP (20x20); ComponentLink1URL: http://www.xilinx.com/support/documentation/data_sheets/ds160.pdf; ComponentLink1Description: http://www.xilinx.com/support/documentation/data_sheets/ds160.pdf; Value: XC6SLX9-2TQG144C; Supplier 2: Digi-Key
U5 = M25PE16-VMW6TG: IC FLASH 16MBIT 75MHZ 8SOIC; Manufacturer: Numonyx/ST Micro; Memory Size: 16M (2M x 8); Interface: SPI, 3-Wire Serial; Voltage - Supply: 2.7 V ~ 3.6 V; Supplier 1: Digi-Key; Manufacturer Part Number: M25PE16-VMW6TG; RoHS: RoHS Compliant; Category: Integrated Circuits (ICs); Stock 1: 866; Pricing 1: 1=2.31, 10=1.98, 25=1.782, 100=1.617, 250=1.452, 500=1.254 (USD); Format - Memory: FLASH; Memory Type: FLASH; Speed: 75MHz; Operating Temperature: -40°C ~ 85°C; Package / Case: 8-SOIC (0.200", 5.30mm Width); Packaging: Cut Tape (CT); Supplier Device Package: *; ComponentLink1URL: http://www.numonyx.com/Documents/Datasheets/M25PE16.pdf; ComponentLink1Description: http://www.numonyx.com/Documents/Datasheets/M25PE16.pdf; Supplier Part Number 1: M25PE16-VMW6TGCT-ND; Value: M25PE16

## Sheet LOGIC_FPGA.SchDoc: FPGA Logic
size B; Engineer: M. Jones; Organization: Michael Jones; DocumentNumber: 4; Revision: RA.1; SheetNumber: 4; SheetTotal: 7
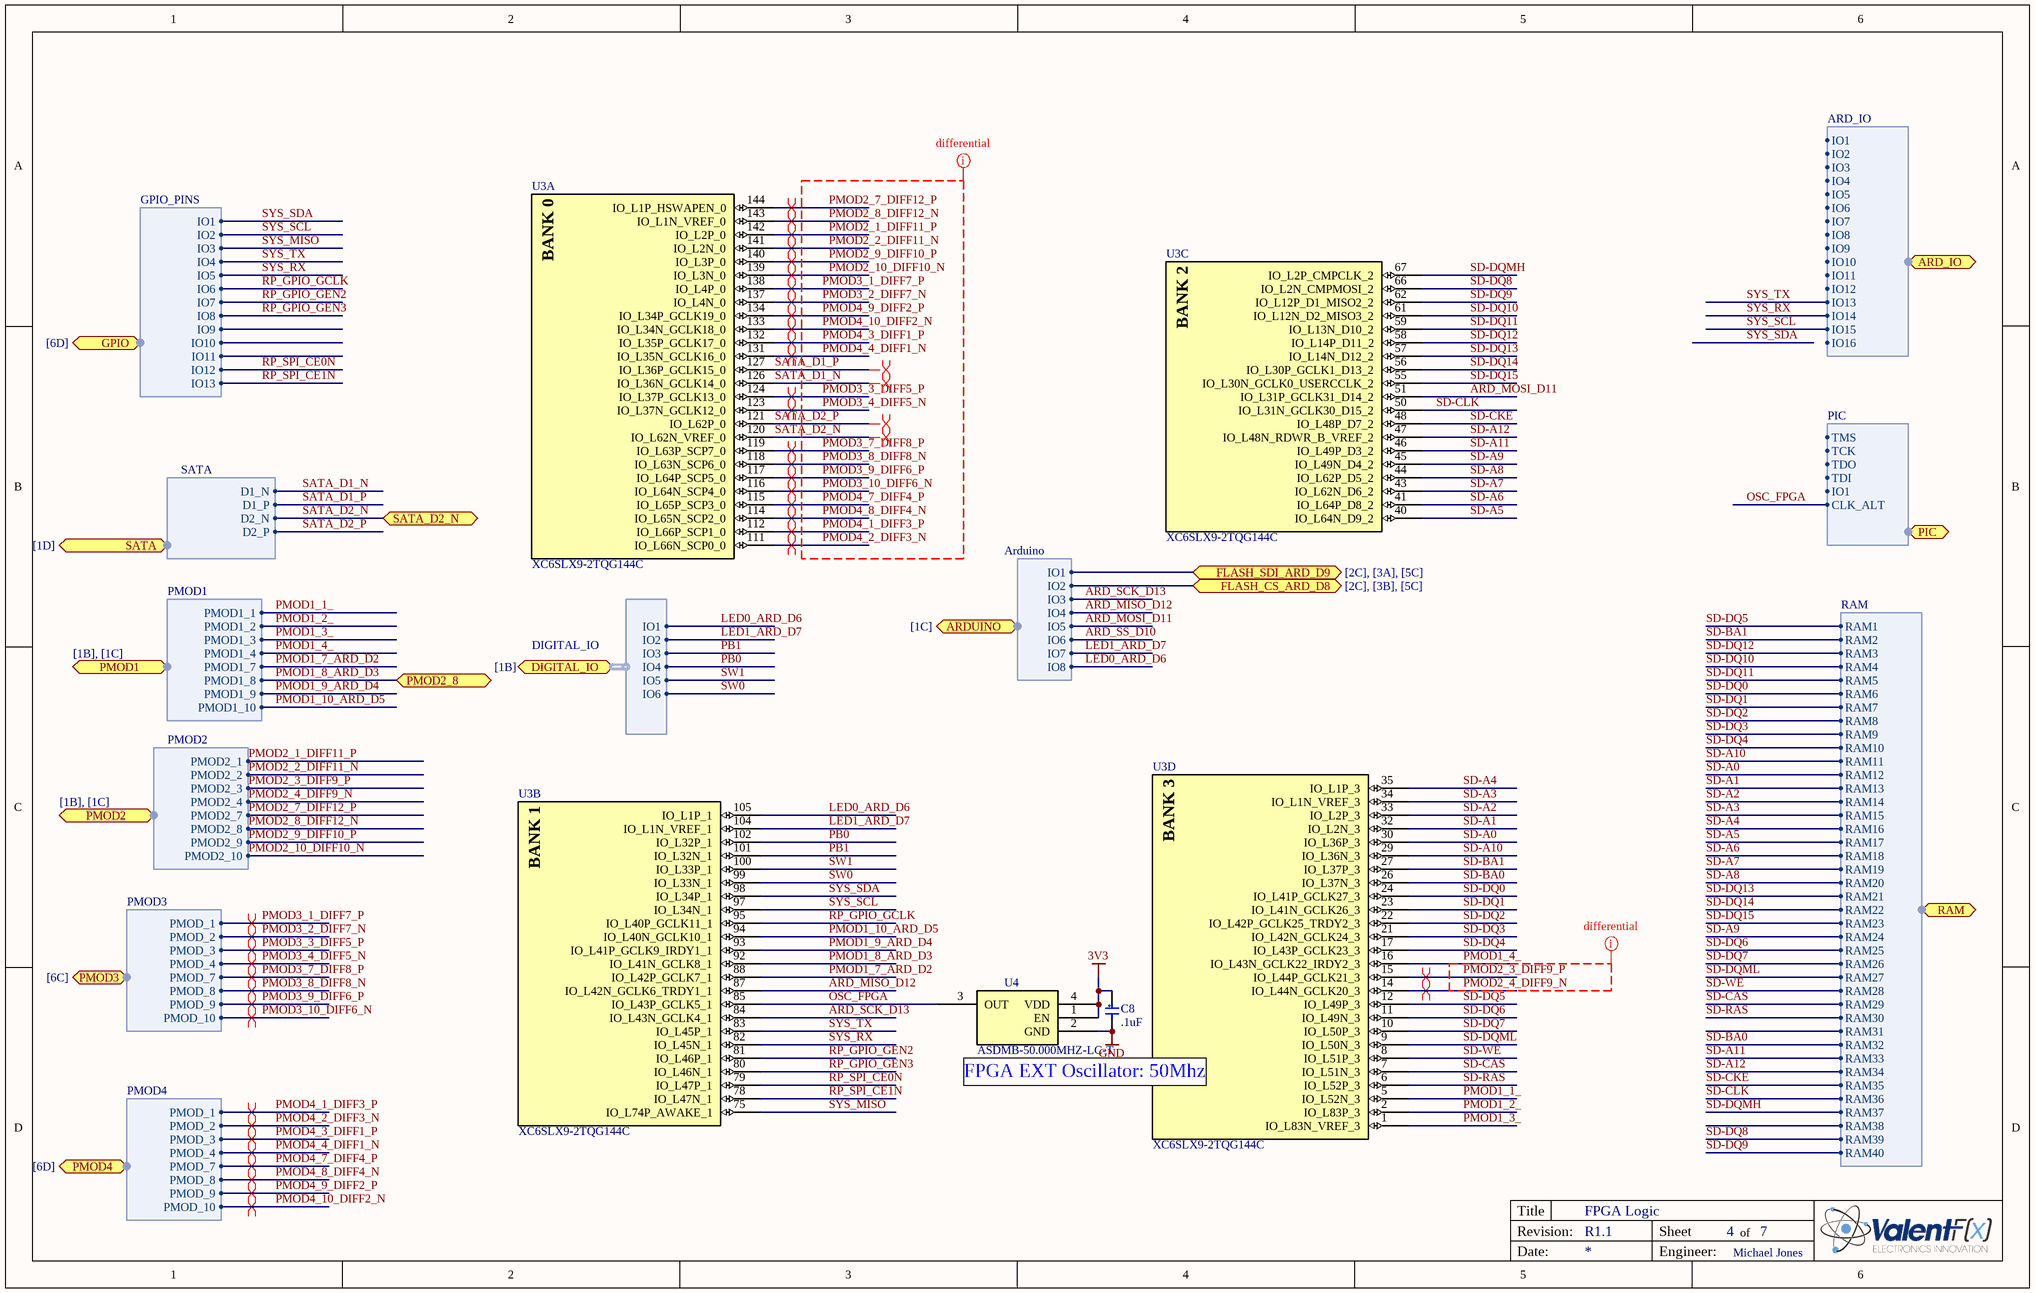
[diagram p3: LOGIC_FPGA.SchDoc]

### Parts
C8  .1uF  [c0603]
U3  XC6SLX9-2TQG144C  [TQ144_L]  (parts A,B,C,D of 7)
U4  ASDMB-50.000MHZ-LC-T  [ASDMB - osc]

### Ports
ARD_IO (harness ARD_IO, see [6B]), ARDUINO (harness Arduino, see [1C]), DIGITAL_IO (harness DIGITAL_IO, see [1B]), FLASH_CS_ARD_D8 (see [2C], [3B], [5C]), FLASH_SDI_ARD_D9 (see [2C], [3A], [5C]), GPIO (harness GPIO_PINS, see [6D]), PIC (harness PIC, see [1C]), PMOD1 (harness PMOD1, see [1B], [1C]), PMOD2 (harness PMOD2, see [1B], [1C]), PMOD2_8, PMOD3 (harness PMOD3, see [6C]), PMOD4 (harness PMOD4, see [6D]), RAM (harness RAM, see [1C]), SATA (harness SATA, see [1D]), SATA_D2_N

### Harnesses
SATA: D1_P, D1_N, D2_N, D2_P
RAM: RAM1, RAM2, RAM3, RAM4, RAM5, RAM6, RAM7, RAM8, RAM9, RAM10, RAM11, RAM12, RAM13, RAM14, RAM15, RAM16, RAM17, RAM18, RAM19, RAM20, RAM21, RAM22, RAM23, RAM24, RAM25, RAM26, RAM27, RAM28, RAM29, RAM30, RAM31, RAM32, RAM33, RAM34, RAM35, RAM36, RAM37, RAM38, RAM39, RAM40
GPIO_PINS: IO3, IO4, IO5, IO6, IO7, IO8, IO9, IO10, IO11, IO12, IO13, IO1, IO2
PMOD3: PMOD_7, PMOD_8, PMOD_9, PMOD_10, PMOD_1, PMOD_2, PMOD_3, PMOD_4
PMOD4: PMOD_7, PMOD_8, PMOD_9, PMOD_10, PMOD_1, PMOD_2, PMOD_3, PMOD_4
ARD_IO: IO3, IO4, IO5, IO6, IO7, IO8, IO9, IO10, IO11, IO12, IO13, IO1, IO2, IO14, IO15, IO16
PIC: TMS, TCK, TDO, TDI, CLK_ALT, IO1
DIGITAL_IO: IO1, IO2, IO3, IO4, IO5, IO6
Arduino: IO1, IO2, IO3, IO4, IO5, IO6, IO7, IO8
PMOD1: PMOD1_1, PMOD1_2, PMOD1_3, PMOD1_4, PMOD1_7, PMOD1_8, PMOD1_9, PMOD1_10
PMOD2: PMOD2_1, PMOD2_2, PMOD2_3, PMOD2_4, PMOD2_7, PMOD2_8, PMOD2_9, PMOD2_10

### Nets
3V3: C8.1 U4.1(EN) U4.4(VDD)
GND: C8.2 U4.2(GND)
ARD_MISO_D12: U3.87(IO_L42N_GCLK6_TRDY1_1) ; port ARDUINO.IO4
ARD_MOSI_D11: U3.51(IO_L31P_GCLK31_D14_2) ; port ARDUINO.IO5
ARD_SCK_D13: U3.84(IO_L43N_GCLK4_1) ; port ARDUINO.IO3
FLASH_CS_ARD_D8: port FLASH_CS_ARD_D8, port ARDUINO.IO2
FLASH_SDI_ARD_D9: port FLASH_SDI_ARD_D9, port ARDUINO.IO1
LED0_ARD_D6: U3.105(IO_L1P_1) ; port DIGITAL_IO.IO1, port ARDUINO.IO8
LED1_ARD_D7: U3.104(IO_L1N_VREF_1) ; port DIGITAL_IO.IO2, port ARDUINO.IO7
OSC_FPGA: U3.85(IO_L43P_GCLK5_1) U4.3(OUT) ; port PIC.CLK_ALT
PB0: U3.102(IO_L32P_1) ; port DIGITAL_IO.IO4
PB1: U3.101(IO_L32N_1) ; port DIGITAL_IO.IO3
PMOD1_1_: U3.5(IO_L52N_3) ; port PMOD1.PMOD1_1
PMOD1_2_: U3.2(IO_L83P_3) ; port PMOD1.PMOD1_2
PMOD1_3_: U3.1(IO_L83N_VREF_3) ; port PMOD1.PMOD1_3
PMOD1_4_: U3.16(IO_L43N_GCLK22_IRDY2_3) ; port PMOD1.PMOD1_4
PMOD1_7_ARD_D2: U3.88(IO_L42P_GCLK7_1) ; port PMOD1.PMOD1_7
PMOD1_8_ARD_D3: U3.92(IO_L41N_GCLK8_1) ; port PMOD2_8, port PMOD1.PMOD1_8
PMOD1_9_ARD_D4: U3.93(IO_L41P_GCLK9_IRDY1_1) ; port PMOD1.PMOD1_9
PMOD1_10_ARD_D5: U3.94(IO_L40N_GCLK10_1) ; port PMOD1.PMOD1_10
PMOD2_1_DIFF11_P: U3.142(IO_L2P_0) ; port PMOD2.PMOD2_1  [project net PMOD1_1_]
PMOD2_2_DIFF11_N: U3.141(IO_L2N_0) ; port PMOD2.PMOD2_2  [project net PMOD1_2_]
PMOD2_3_DIFF9_P: U3.15(IO_L44P_GCLK21_3) ; port PMOD2.PMOD2_3  [project net PMOD1_3_]
PMOD2_4_DIFF9_N: U3.14(IO_L44N_GCLK20_3) ; port PMOD2.PMOD2_4  [project net PMOD1_4_]
PMOD2_7_DIFF12_P: U3.144(IO_L1P_HSWAPEN_0) ; port PMOD2.PMOD2_7  [project net PMOD1_7_ARD_D2]
PMOD2_8_DIFF12_N: U3.143(IO_L1N_VREF_0) ; port PMOD2.PMOD2_8  [project net PMOD1_8_ARD_D3]
PMOD2_9_DIFF10_P: U3.140(IO_L3P_0) ; port PMOD2.PMOD2_9  [project net PMOD1_9_ARD_D4]
PMOD2_10_DIFF10_N: U3.139(IO_L3N_0) ; port PMOD2.PMOD2_10  [project net PMOD1_10_ARD_D5]
PMOD3_1_DIFF7_P: U3.138(IO_L4P_0) ; port PMOD3.PMOD_1
PMOD3_2_DIFF7_N: U3.137(IO_L4N_0) ; port PMOD3.PMOD_2
PMOD3_3_DIFF5_P: U3.124(IO_L37P_GCLK13_0) ; port PMOD3.PMOD_3
PMOD3_4_DIFF5_N: U3.123(IO_L37N_GCLK12_0) ; port PMOD3.PMOD_4
PMOD3_7_DIFF8_P: U3.119(IO_L63P_SCP7_0) ; port PMOD3.PMOD_7
PMOD3_8_DIFF8_N: U3.118(IO_L63N_SCP6_0) ; port PMOD3.PMOD_8
PMOD3_9_DIFF6_P: U3.117(IO_L64P_SCP5_0) ; port PMOD3.PMOD_9
PMOD3_10_DIFF6_N: U3.116(IO_L64N_SCP4_0) ; port PMOD3.PMOD_10
PMOD4_1_DIFF3_P: U3.112(IO_L66P_SCP1_0) ; port PMOD4.PMOD_1
PMOD4_2_DIFF3_N: U3.111(IO_L66N_SCP0_0) ; port PMOD4.PMOD_2
PMOD4_3_DIFF1_P: U3.132(IO_L35P_GCLK17_0) ; port PMOD4.PMOD_3
PMOD4_4_DIFF1_N: U3.131(IO_L35N_GCLK16_0) ; port PMOD4.PMOD_4
PMOD4_7_DIFF4_P: U3.115(IO_L65P_SCP3_0) ; port PMOD4.PMOD_7
PMOD4_8_DIFF4_N: U3.114(IO_L65N_SCP2_0) ; port PMOD4.PMOD_8
PMOD4_9_DIFF2_P: U3.134(IO_L34P_GCLK19_0) ; port PMOD4.PMOD_9
PMOD4_10_DIFF2_N: U3.133(IO_L34N_GCLK18_0) ; port PMOD4.PMOD_10
RP_GPIO_GCLK: U3.95(IO_L40P_GCLK11_1) ; port GPIO.IO6
RP_GPIO_GEN2: U3.81(IO_L46P_1) ; port GPIO.IO7
RP_GPIO_GEN3: U3.80(IO_L46N_1) ; port GPIO.IO8
RP_SPI_CE0N: U3.79(IO_L47P_1) ; port GPIO.IO12
RP_SPI_CE1N: U3.78(IO_L47N_1) ; port GPIO.IO13
SATA_D1_N: U3.126(IO_L36N_GCLK14_0) ; port SATA.D1_N
SATA_D1_P: U3.127(IO_L36P_GCLK15_0) ; port SATA.D1_P
SATA_D2_N: U3.120(IO_L62N_VREF_0) ; port SATA_D2_N, port SATA.D2_N
SATA_D2_P: U3.121(IO_L62P_0) ; port SATA.D2_P
SD-A0: U3.30(IO_L36P_3) ; port RAM.RAM12
SD-A1: U3.32(IO_L2N_3) ; port RAM.RAM13
SD-A2: U3.33(IO_L2P_3) ; port RAM.RAM14
SD-A3: U3.34(IO_L1N_VREF_3) ; port RAM.RAM15
SD-A4: U3.35(IO_L1P_3) ; port RAM.RAM16
SD-A5: U3.40(IO_L64N_D9_2) ; port RAM.RAM17
SD-A6: U3.41(IO_L64P_D8_2) ; port RAM.RAM18
SD-A7: U3.43(IO_L62N_D6_2) ; port RAM.RAM19
SD-A8: U3.44(IO_L62P_D5_2) ; port RAM.RAM20
SD-A9: U3.45(IO_L49N_D4_2) ; port RAM.RAM24
SD-A10: U3.29(IO_L36N_3) ; port RAM.RAM11
SD-A11: U3.46(IO_L49P_D3_2) ; port RAM.RAM33
SD-A12: U3.47(IO_L48N_RDWR_B_VREF_2) ; port RAM.RAM34
SD-BA0: U3.26(IO_L37N_3) ; port RAM.RAM32
SD-BA1: U3.27(IO_L37P_3) ; port RAM.RAM2
SD-CAS: U3.7(IO_L51N_3) ; port RAM.RAM29
SD-CKE: U3.48(IO_L48P_D7_2) ; port RAM.RAM35
SD-CLK: U3.50(IO_L31N_GCLK30_D15_2) ; port RAM.RAM36
SD-DQ0: U3.24(IO_L41P_GCLK27_3) ; port RAM.RAM6
SD-DQ1: U3.23(IO_L41N_GCLK26_3) ; port RAM.RAM7
SD-DQ2: U3.22(IO_L42P_GCLK25_TRDY2_3) ; port RAM.RAM8
SD-DQ3: U3.21(IO_L42N_GCLK24_3) ; port RAM.RAM9
SD-DQ4: U3.17(IO_L43P_GCLK23_3) ; port RAM.RAM10
SD-DQ5: U3.12(IO_L49P_3) ; port RAM.RAM1
SD-DQ6: U3.11(IO_L49N_3) ; port RAM.RAM25
SD-DQ7: U3.10(IO_L50P_3) ; port RAM.RAM26
SD-DQ8: U3.66(IO_L2N_CMPMOSI_2) ; port RAM.RAM39
SD-DQ9: U3.62(IO_L12P_D1_MISO2_2) ; port RAM.RAM40
SD-DQ10: U3.61(IO_L12N_D2_MISO3_2) ; port RAM.RAM4
SD-DQ11: U3.59(IO_L13N_D10_2) ; port RAM.RAM5
SD-DQ12: U3.58(IO_L14P_D11_2) ; port RAM.RAM3
SD-DQ13: U3.57(IO_L14N_D12_2) ; port RAM.RAM21
SD-DQ14: U3.56(IO_L30P_GCLK1_D13_2) ; port RAM.RAM22
SD-DQ15: U3.55(IO_L30N_GCLK0_USERCCLK_2) ; port RAM.RAM23
SD-DQMH: U3.67(IO_L2P_CMPCLK_2) ; port RAM.RAM37
SD-DQML: U3.9(IO_L50N_3) ; port RAM.RAM27
SD-RAS: U3.6(IO_L52P_3) ; port RAM.RAM30
SD-WE: U3.8(IO_L51P_3) ; port RAM.RAM28
SW0: U3.99(IO_L33N_1) ; port DIGITAL_IO.IO6
SW1: U3.100(IO_L33P_1) ; port DIGITAL_IO.IO5
SYS_MISO: U3.75(IO_L74P_AWAKE_1) ; port GPIO.IO3
SYS_RX: U3.82(IO_L45N_1) ; port GPIO.IO5, port ARD_IO.IO14
SYS_SCL: U3.97(IO_L34N_1) ; port GPIO.IO2, port ARD_IO.IO15
SYS_SDA: U3.98(IO_L34P_1) ; port GPIO.IO1, port ARD_IO.IO16
SYS_TX: U3.83(IO_L45P_1) ; port GPIO.IO4, port ARD_IO.IO13

### Layout directives
net class differential: PMOD1_4_, PMOD2_1_DIFF11_P, PMOD2_2_DIFF11_N, PMOD2_3_DIFF9_P, PMOD2_4_DIFF9_N, PMOD2_7_DIFF12_P, PMOD2_8_DIFF12_N, PMOD2_9_DIFF10_P, PMOD2_10_DIFF10_N, PMOD3_1_DIFF7_P, PMOD3_2_DIFF7_N, PMOD3_3_DIFF5_P, PMOD3_4_DIFF5_N, PMOD3_7_DIFF8_P, PMOD3_8_DIFF8_N, PMOD3_9_DIFF6_P, PMOD3_10_DIFF6_N, PMOD4_1_DIFF3_P, PMOD4_2_DIFF3_N, PMOD4_3_DIFF1_P, PMOD4_4_DIFF1_N, PMOD4_7_DIFF4_P, PMOD4_8_DIFF4_N, PMOD4_9_DIFF2_P, PMOD4_10_DIFF2_N
differential pair: PMOD1_1_, PMOD1_2_, PMOD1_3_, PMOD1_4_, PMOD1_7_ARD_D2, PMOD1_8_ARD_D3, PMOD1_9_ARD_D4, PMOD1_10_ARD_D5, PMOD3_1_DIFF7_P, PMOD3_2_DIFF7_N, PMOD3_3_DIFF5_P, PMOD3_4_DIFF5_N, PMOD3_7_DIFF8_P, PMOD3_8_DIFF8_N, PMOD3_9_DIFF6_P, PMOD3_10_DIFF6_N, PMOD4_1_DIFF3_P, PMOD4_2_DIFF3_N, PMOD4_3_DIFF1_P, PMOD4_4_DIFF1_N, PMOD4_7_DIFF4_P, PMOD4_8_DIFF4_N, PMOD4_9_DIFF2_P, PMOD4_10_DIFF2_N, SATA_D1_N, SATA_D1_P, SATA_D2_N, SATA_D2_P

### Notes on the sheet
- FPGA EXT Oscillator: 50Mhz
- Title
- Revision:
- Sheet
- of
- Date:
- Engineer:
- (in symbol FPGA - XC6SLX9-2TQG144C, part A) BANK 0
- (in symbol FPGA - XC6SLX9-2TQG144C, part B) BANK 1
- (in symbol FPGA - XC6SLX9-2TQG144C, part C) BANK 2
- (in symbol FPGA - XC6SLX9-2TQG144C, part D) BANK 3

### Library data of the parts
C8 = C0603 - CL10F104ZA8NNNC: as C2 on sheet DIGITAL_IO; Manufacturer Part Number: CL10F104ZA8NNNC; Value: .1uF; Supplier 1: Digi-Key; Supplier Part Number 1: 1276-1011-1-ND; RoHS: RoHS Compliant; Category: Capacitors; Stock 1: 400907; Pricing 1: 1=0.1, 10=0.017, 25=0.012, 50=0.009, 100=0.0076, 250=0.00624, 500=0.00536, 1000=0.00417 (USD); Package / Case: 0603 (1608 Metric); Packaging: Cut Tape (CT); ComponentLink1URL: http://www.samsungsem.com/servlet/FileDownload?type=spec&file=CL10F104ZA8NNNC.pdf; ComponentLink1Description: http://www.samsungsem.com/servlet/FileDownload?type=spec&file=CL10F104ZA8NNNC.pdf; Voltage - Rated: 25V; Mounting Type: Surface Mount, MLCC; Operating Temperature: -30°C ~ 85°C; Applications: General Purpose; Ratings: -; Size / Dimension: 0.063" L x 0.031" W (1.60mm x 0.80mm); Height - Seated (Max): -; Thickness (Max): 0.035" (0.90mm); Lead Spacing: -; Features: -; Lead Style: -
U3 = FPGA - XC6SLX9-2TQG144C: as U3 on sheet FPGA_POWER_AND_CONFIGURATION; Supplier 1: America II Electronics; Supplier Part Number 1: 122-1745-ND; Manufacturer Part Number: XC6SLX9-2TQG144C; RoHS: RoHS Compliant; Category: Integrated Circuits (ICs); Stock 1: 994; Pricing 1: 1=12.80,1=11.05,1000=9.59 (USD); Number of Gates: -; Mounting Type: Surface Mount; Operating Temperature: 0°C ~ 85°C; Package / Case: 144-LQFP; Supplier Device Package: 144-TQFP (20x20); ComponentLink1URL: http://www.xilinx.com/support/documentation/data_sheets/ds160.pdf; ComponentLink1Description: http://www.xilinx.com/support/documentation/data_sheets/ds160.pdf; Value: XC6SLX9-2TQG144C; Supplier 2: Digi-Key
U4 = ASDMB-50.000MHZ-LC-T: OSC MEMS 50.000 MHZ SMD; Manufacturer: Abracon Corporation; Frequency: 50MHz; Function: Tri-State (Output Enable); Output: CMOS; Voltage - Supply: 1.8 V ~ 3.3 V; Frequency Stability: ±50ppm; Current - Supply (Max): 16mA; Current - Supply (Disable) (Max): 15µA; Supplier 1: Digi-Key; Manufacturer Part Number: ASDMB-50.000MHZ-LC-T; RoHS: RoHS Compliant; Category: Crystals and Oscillators; Stock 1: 967; Pricing 1: 1=1.69, 10=1.463, 50=1.2826, 100=1.0125, 500=0.855 (USD); Type: MEMS (Silicon); Operating Temperature: -40°C ~ 85°C; Mounting Type: Surface Mount; Size / Dimension: 0.098" L x 0.079" W (2.50mm x 2.00mm); Height: 0.035" (0.90mm); Package / Case: 4-SMD, No Lead (DFN, LCC); Packaging: Cut Tape (CT); ComponentLink1URL: http://www.abracon.com/Oscillators/ASDMB.pdf; ComponentLink1Description: http://www.abracon.com/Oscillators/ASDMB.pdf; Supplier Part Number 1: 535-11738-1-ND; Value: ASDMB-50.000MHZ-LC-T

## Sheet PERIPHERAL_PORT_IO.SchDoc: Peripheral Port IO
size B; Engineer: M. Jones; Organization: Michael Jones; DocumentNumber: 5; Revision: RA.1; SheetNumber: 5; SheetTotal: 7
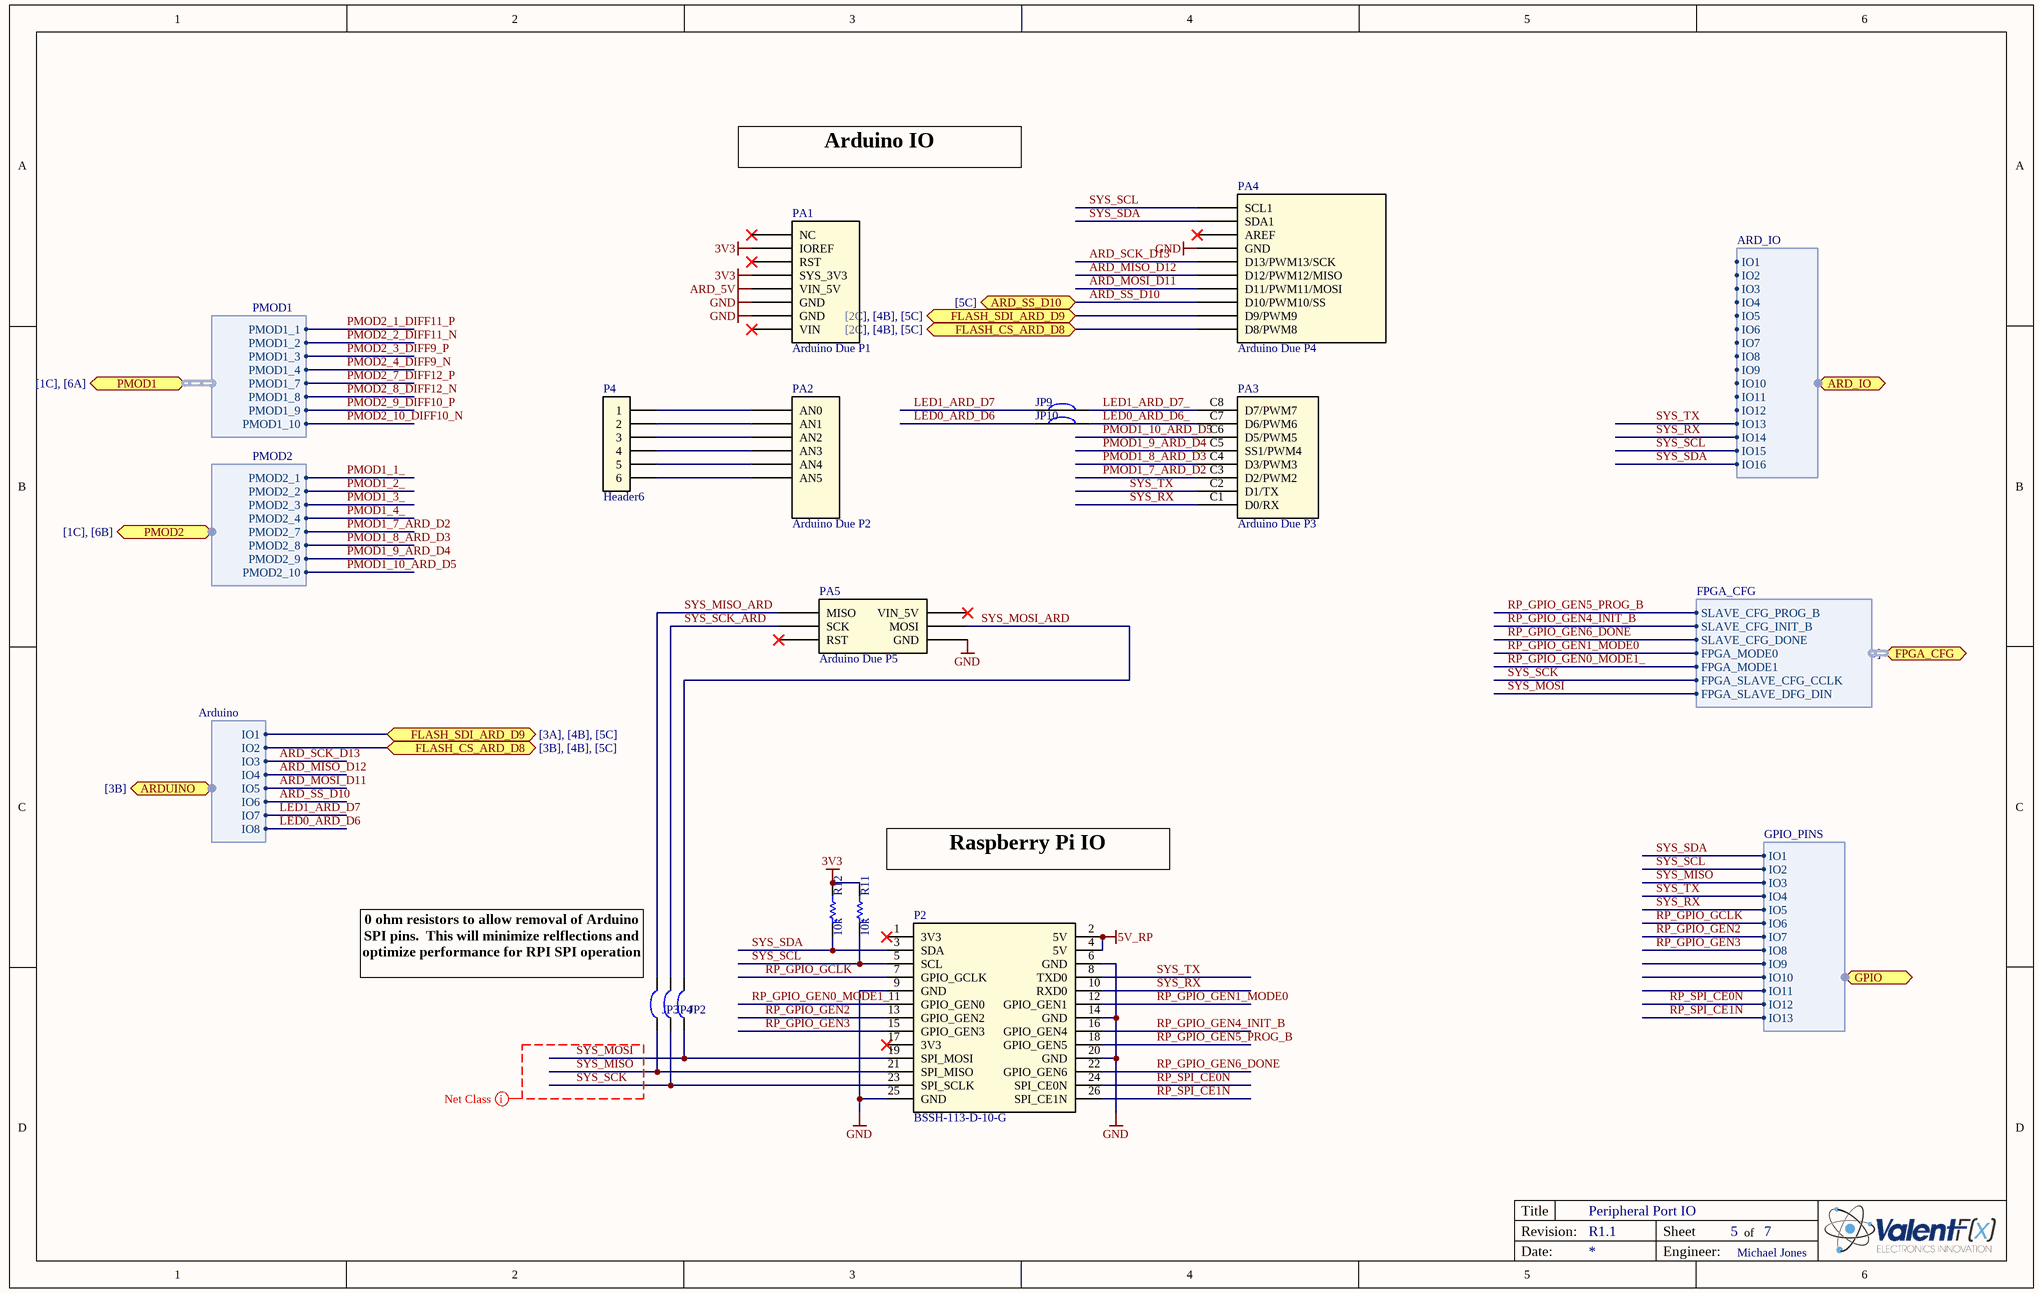
[diagram p4: PERIPHERAL_PORT_IO.SchDoc]

### Parts
JP2  Solder Jumper  [SOLDER_JUMPER]  (value not drawn)  (no BOM)
JP3  Solder Jumper  [SOLDER_JUMPER]  (value not drawn)  (no BOM)
JP4  Solder Jumper  [SOLDER_JUMPER]  (value not drawn)  (no BOM)
JP9  Solder Jumper-NC  [SOLDER_JUMPER-NC]  (value not drawn)  (net tie, no BOM)
JP10  Solder Jumper-NC  [SOLDER_JUMPER-NC]  (value not drawn)  (net tie, no BOM)
P2  BSSH-113-D-10-G  [Raspberr Pi - 26]
P4  Header6  [HEADER_6_40_100 THRU SIP]  (no BOM)
PA1  Arduino Due P1  [Arduino Due P1]
PA2  Arduino Due P2  [Arduino Due P2]
PA3  Arduino Due P3  [Arduino Due P3]
PA4  Arduino Due P4  [Arduino Due P4]
PA5  Arduino Due P5  [Arduino Due P5]  (no BOM)
R11  10k  [R0603]
R12  10k  [R0603]

### Ports
ARD_IO (harness ARD_IO, see [6A]), ARD_SS_D10 (see [5C]), ARDUINO (harness Arduino, see [3B]), FLASH_CS_ARD_D8 (see [2C], [4B], [5C]), FLASH_CS_ARD_D8 (see [3B], [4B], [5C]), FLASH_SDI_ARD_D9 (see [2C], [4B], [5C]), FLASH_SDI_ARD_D9 (see [3A], [4B], [5C]), FPGA_CFG (harness FPGA_CFG, see [1D]), GPIO (harness GPIO_PINS, see [1B]), PMOD1 (harness PMOD1, see [1C], [6A]), PMOD2 (harness PMOD2, see [1C], [6B])

### Harnesses
GPIO_PINS: IO3, IO4, IO5, IO6, IO7, IO8, IO9, IO10, IO11, IO12, IO13, IO1, IO2
FPGA_CFG: SLAVE_CFG_PROG_B, SLAVE_CFG_INIT_B, SLAVE_CFG_DONE, FPGA_MODE0, FPGA_MODE1, FPGA_SLAVE_CFG_CCLK, FPGA_SLAVE_DFG_DIN
ARD_IO: IO3, IO4, IO5, IO6, IO7, IO8, IO9, IO10, IO11, IO12, IO13, IO1, IO2, IO14, IO15, IO16
PMOD1: PMOD1_1, PMOD1_2, PMOD1_3, PMOD1_4, PMOD1_7, PMOD1_8, PMOD1_9, PMOD1_10
PMOD2: PMOD2_1, PMOD2_2, PMOD2_3, PMOD2_4, PMOD2_7, PMOD2_8, PMOD2_9, PMOD2_10
Arduino: IO1, IO2, IO3, IO4, IO5, IO6, IO7, IO8

### Nets
3V3: PA1.A2(IOREF) PA1.A4(SYS_3V3) R11.2 R12.2
5V_RP: P2.2(5V) P2.4(5V)
ARD_5V: PA1.A5(VIN_5V)
GND: P2.6(GND) P2.9(GND) P2.14(GND) P2.20(GND) P2.25(GND) PA1.A6(GND) PA1.A7(GND) PA4.D7(GND) PA5.E6(GND)
ARD_MISO_D12: PA4.D5(D12/PWM12/MISO) ; port ARDUINO.IO4
ARD_MOSI_D11: PA4.D4(D11/PWM11/MOSI) ; port ARDUINO.IO5
ARD_SCK_D13: PA4.D6(D13/PWM13/SCK) ; port ARDUINO.IO3
ARD_SS_D10: PA4.D3(D10/PWM10/SS) ; port ARD_SS_D10, port ARDUINO.IO6
FLASH_CS_ARD_D8: PA4.D1(D8/PWM8) ; port FLASH_CS_ARD_D8, port ARDUINO.IO2
FLASH_SDI_ARD_D9: PA4.D2(D9/PWM9) ; port FLASH_SDI_ARD_D9, port ARDUINO.IO1
LED0_ARD_D6: JP10.1 ; port ARDUINO.IO8
LED0_ARD_D6_: JP10.2 PA3.C7(D6/PWM6)
LED1_ARD_D7: JP9.1 ; port ARDUINO.IO7
LED1_ARD_D7_: JP9.2 PA3.C8(D7/PWM7)
PMOD1_7_ARD_D2: PA3.C3(D2/PWM2) ; port PMOD2.PMOD2_7
PMOD1_8_ARD_D3: PA3.C4(D3/PWM3) ; port PMOD2.PMOD2_8
PMOD1_9_ARD_D4: PA3.C5(SS1/PWM4) ; port PMOD2.PMOD2_9
PMOD1_10_ARD_D5: PA3.C6(D5/PWM5) ; port PMOD2.PMOD2_10
RP_GPIO_GCLK: P2.7(GPIO_GCLK) ; port GPIO.IO6
RP_GPIO_GEN0_MODE1_: P2.11(GPIO_GEN0) ; port FPGA_CFG.FPGA_MODE1
RP_GPIO_GEN1_MODE0: P2.12(GPIO_GEN1) ; port FPGA_CFG.FPGA_MODE0
RP_GPIO_GEN2: P2.13(GPIO_GEN2) ; port GPIO.IO7
RP_GPIO_GEN3: P2.15(GPIO_GEN3) ; port GPIO.IO8
RP_GPIO_GEN4_INIT_B: P2.16(GPIO_GEN4) ; port FPGA_CFG.SLAVE_CFG_INIT_B
RP_GPIO_GEN5_PROG_B: P2.18(GPIO_GEN5) ; port FPGA_CFG.SLAVE_CFG_PROG_B
RP_GPIO_GEN6_DONE: P2.22(GPIO_GEN6) ; port FPGA_CFG.SLAVE_CFG_DONE
RP_SPI_CE0N: P2.24(SPI_CE0N) ; port GPIO.IO12
RP_SPI_CE1N: P2.26(SPI_CE1N) ; port GPIO.IO13
SYS_MISO: JP3.1 P2.21(SPI_MISO) ; port GPIO.IO3
SYS_MISO_ARD: JP3.2 PA5.E1(MISO)
SYS_MOSI: JP2.1 P2.19(SPI_MOSI) ; port FPGA_CFG.FPGA_SLAVE_DFG_DIN
SYS_MOSI_ARD: JP2.2 PA5.E4(MOSI)
SYS_RX: P2.10(RXD0) PA3.C1(D0/RX) ; port GPIO.IO5, port ARD_IO.IO14
SYS_SCK: JP4.1 P2.23(SPI_SCLK) ; port FPGA_CFG.FPGA_SLAVE_CFG_CCLK
SYS_SCK_ARD: JP4.2 PA5.E3(SCK)
SYS_SCL: P2.5(SCL) PA4.D10(SCL1) R11.1 ; port GPIO.IO2, port ARD_IO.IO15
SYS_SDA: P2.3(SDA) PA4.D9(SDA1) R12.1 ; port GPIO.IO1, port ARD_IO.IO16
SYS_TX: P2.8(TXD0) PA3.C2(D1/TX) ; port GPIO.IO4, port ARD_IO.IO13
NetP4_1: P4.1 PA2.B1(AN0)
NetP4_2: P4.2 PA2.B2(AN1)
NetP4_3: P4.3 PA2.B3(AN2)
NetP4_4: P4.4 PA2.B4(AN3)
NetP4_5: P4.5 PA2.B5(AN4)
NetP4_6: P4.6 PA2.B6(AN5)

Not connected (* = marked no-connect by the designer): P2 1(3V3)* 17(3V3)*; PA1 A1(NC)* A3(RST)* A8(VIN)*; PA4 D8(AREF)*; PA5 E2(VIN_5V)* E5(RST)*

### Layout directives
net class SPI: SYS_MISO, SYS_MOSI, SYS_SCK

### Notes on the sheet
- Arduino IO
- Raspberry Pi IO
- 0 ohm resistors to allow removal of Arduino SPI pins.  This will minimize relflections and optimize performance for RPI SPI operation
- Title
- Revision:
- Sheet
- of
- Date:
- Engineer:

### Library data of the parts
JP2-JP4 = Solder Jumper: Solder/Configuration Jumper; Manufacturer: n/a; Manufacturer Part Number: n/a; Source: n/a; Source Part Number: n/a; ROHS Certificate: n/a
JP9 JP10 = Solder Jumper-NC: Solder/Configuration Jumper; Manufacturer: n/a; Manufacturer Part Number: n/a; Source: n/a; Source Part Number: n/a; ROHS Certificate: n/a
P2 = Raspberry Pi - 26: Manufacturer: Major League Electroncis; Datasheet: http://s3.amazonaws.com/mlkelly/productMedia/BSSH-1/BSSH-1-D-Datasheet.pdf; Price1: 1.95; Value: BSSH-113-D-10-G; Supplier 1: Adafruit; Supplier Part Number 1: BSSH-113-D-10-G; Manufacturer Part Number: BSSH-113-D-10-G
P4 = Header6: Header 6 pin
PA1 = Arduino Due P1: CONN HEADER FEMALE 8POS .1" GOLD; Manufacturer: Sullins Connector Solutions; Manufacturer Part Number: PPPC081LFBN-RC; Number of Positions: 8; Number of Positions Loaded: All; Pitch: 0.100" (2.54mm); Supplier 1: Digi-Key; RoHS: RoHS Compliant; Category: Connectors, Interconnects; Stock 1: 30245; Pricing 1: 1=0.89, 10=0.69, 25=0.6436, 50=0.585, 100=0.5265, 250=0.4446, 500=0.4212, 1000=0.3744, 2500=0.31122 (USD); Packaging: Bulk; Connector Type: Header; Contact Type: Female Socket; Number of Rows: 1; Row Spacing: -; Mounting Type: Through Hole; Termination: Solder; Fastening Type: -; Features: -; Contact Finish: Gold; Contact Finish Thickness: Flash; Color: Black; ComponentLink1URL: http://www.sullinscorp.com/drawings/78_P(N)PxCxxxLFBN-RC,_10492-G.pdf; ComponentLink1Description: http://www.sullinscorp.com/drawings/78_P(N)PxCxxxLFBN-RC,_10492-G.pdf; Supplier Part Number 1: S7041-ND
PA2 = Arduino Due P2: CONN HEADER FEMALE 6POS .1" GOLD; Manufacturer: Sullins Connector Solutions; Manufacturer Part Number: PPPC061LFBN-RC; Number of Positions: 6; Number of Positions Loaded: All; Pitch: 0.100" (2.54mm); Supplier 1: Digi-Key; RoHS: RoHS Compliant; Category: Connectors, Interconnects; Stock 1: 9213; Pricing 1: 1=0.7, 10=0.546, 25=0.5088, 50=0.4626, 100=0.4163, 250=0.35152, 500=0.333, 1000=0.296, 2500=0.24605 (USD); Packaging: Bulk; Connector Type: Header; Contact Type: Female Socket; Number of Rows: 1; Row Spacing: -; Mounting Type: Through Hole; Termination: Solder; Fastening Type: -; Features: -; Contact Finish: Gold; Contact Finish Thickness: Flash; Color: Black; ComponentLink1URL: http://www.sullinscorp.com/drawings/78_P(N)PxCxxxLFBN-RC,_10492-G.pdf; ComponentLink1Description: http://www.sullinscorp.com/drawings/78_P(N)PxCxxxLFBN-RC,_10492-G.pdf; Supplier Part Number 1: S7039-ND
PA3 = Arduino Due P3: CONN HEADER FEMALE 8POS .1" GOLD; Manufacturer: Sullins Connector Solutions; Manufacturer Part Number: PPPC081LFBN-RC; Number of Positions: 8; Number of Positions Loaded: All; Pitch: 0.100" (2.54mm); Supplier 1: Digi-Key; RoHS: RoHS Compliant; Category: Connectors, Interconnects; Stock 1: 30245; Pricing 1: 1=0.89, 10=0.69, 25=0.6436, 50=0.585, 100=0.5265, 250=0.4446, 500=0.4212, 1000=0.3744, 2500=0.31122 (USD); Packaging: Bulk; Connector Type: Header; Contact Type: Female Socket; Number of Rows: 1; Row Spacing: -; Mounting Type: Through Hole; Termination: Solder; Fastening Type: -; Features: -; Contact Finish: Gold; Contact Finish Thickness: Flash; Color: Black; ComponentLink1URL: http://www.sullinscorp.com/drawings/78_P(N)PxCxxxLFBN-RC,_10492-G.pdf; ComponentLink1Description: http://www.sullinscorp.com/drawings/78_P(N)PxCxxxLFBN-RC,_10492-G.pdf; Supplier Part Number 1: S7041-ND
PA4 = Arduino Due P4: CONN HEADER FMALE 10POS .1" GOLD; Manufacturer: Sullins Connector Solutions; Manufacturer Part Number: PPPC101LFBN-RC; Number of Positions: 10; Number of Positions Loaded: All; Pitch: 0.100" (2.54mm); Supplier 1: Digi-Key; RoHS: RoHS Compliant; Category: Connectors, Interconnects; Stock 1: 5570; Pricing 1: 1=0.84, 10=0.699, 25=0.6476, 50=0.5828, 100=0.518, 250=0.45324, 500=0.4144, 1000=0.37555, 2500=0.3367 (USD); Packaging: Bulk; Connector Type: Header; Contact Type: Female Socket; Number of Rows: 1; Row Spacing: -; Mounting Type: Through Hole; Termination: Solder; Fastening Type: -; Features: -; Contact Finish: Gold; Contact Finish Thickness: Flash; Color: Black; ComponentLink1URL: http://www.sullinscorp.com/drawings/78_P(N)PxCxxxLFBN-RC,_10492-G.pdf; ComponentLink1Description: http://www.sullinscorp.com/drawings/78_P(N)PxCxxxLFBN-RC,_10492-G.pdf; Supplier Part Number 1: S7043-ND
R11 R12 = R0603 - CRCW060310K0FKEA: as R1 on sheet DIGITAL_IO; Manufacturer Part Number: CRCW060310K0FKEA; Value: 10k; Supplier 1: Digi-Key; RoHS: RoHS Compliant; Category: Resistors; Stock 1: 997856; Pricing 1: 10=0.081, 50=0.0436, 200=0.0251, 1000=0.01711 (USD); Resistance (Ohms): 10K; Composition: Thick Film; Features: -; Tolerance: ±1%; Size / Dimension: 0.061" L x 0.033" W (1.55mm x 0.85mm); Height: 0.020" (0.50mm); Packaging: Cut Tape (CT); Package / Case: 0603 (1608 Metric); ComponentLink1URL: http://www.vishay.com/doc?20035; ComponentLink1Description: http://www.vishay.com/doc?20035; Supplier Part Number 1: 541-10.0KHCT-ND; Number of Terminations: 2